# Altium project GRAVITAS_CCU_HAS.PrjPcb (part 1 of 2)
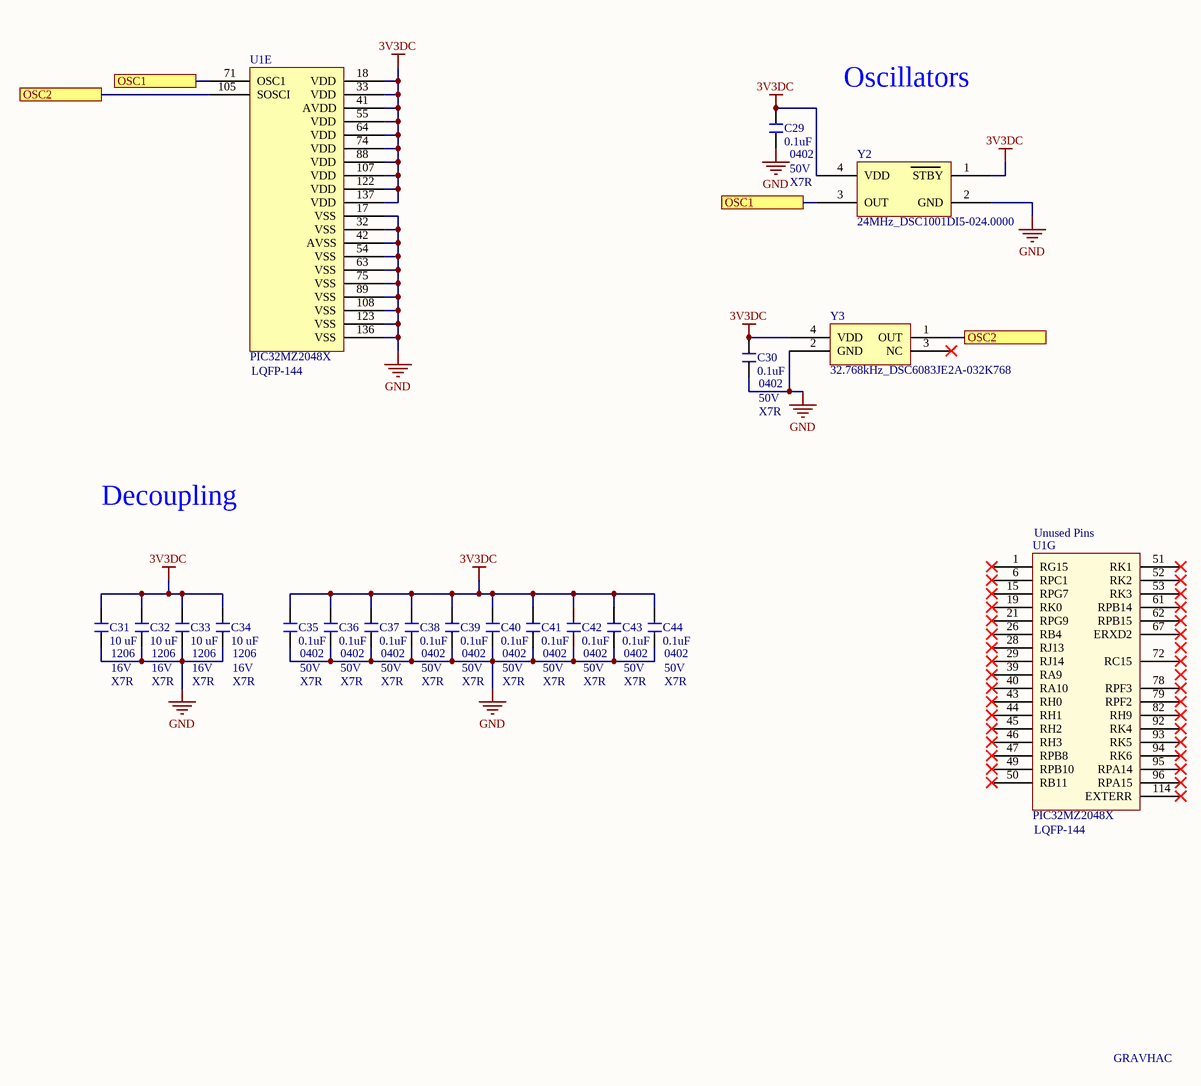
[diagram p0: MCU_SUPPORT_CCU_HAS.SchDoc]
9 sheets, 394 parts. Net scope: flat (ports and power ports of the same name join across sheets).
Board file: CCU.PcbDoc
Sheets:
  MCU_SUPPORT_CCU_HAS.SchDoc
  VREG_CCU_HAS.SchDoc
  UI_CCU_HAS.SchDoc
  USB_BREAKOUTS_CCU_HAS.SchDoc
  ETH_ICD_CCU_HAS.SchDoc
  RS485_CCU_HAS.SchDoc
  CTL_RELAY_SHEET1_CCU_HAS.SchDoc
  CTL_RELAY_SHEET2_CCU_HAS.SchDoc
  HEADERS_HAS_CCU.SchDoc

## Sheet MCU_SUPPORT_CCU_HAS.SchDoc: CCU - Microcontroller Support
size B; DrawnBy: M. Seago; Organization: Gravitas; Address1: Sponsored By:; Address2: Alan Morgan; Address3: Technical Advisor:; Address4: Dr. Joseph Morgan; Revision: 1A; SheetNumber: 1; SheetTotal: 9

### Parts
C29  0.1uF  [NonPolar-0402]
C30  0.1uF  [NonPolar-0402]
C31  10 uF  [NONPOLAR-1206]
C32  10 uF  [NONPOLAR-1206]
C33  10 uF  [NONPOLAR-1206]
C34  10 uF  [NONPOLAR-1206]
C35  0.1uF  [NonPolar-0402]
C36  0.1uF  [NonPolar-0402]
C37  0.1uF  [NonPolar-0402]
C38  0.1uF  [NonPolar-0402]
C39  0.1uF  [NonPolar-0402]
C40  0.1uF  [NonPolar-0402]
C41  0.1uF  [NonPolar-0402]
C42  0.1uF  [NonPolar-0402]
C43  0.1uF  [NonPolar-0402]
C44  0.1uF  [NonPolar-0402]
U1  PIC32MZ2048X  [BIG_PIC32MZ]  (parts E,G of 7)
Y2  24MHz_DSC1001DI5-024.0000  [12MHz_DSC1001DE2-012.0000]
Y3  32.768kHz_DSC6083JE2A-032K768  [32.768kHz_DSC6083JE2A-032K768]

### Ports
OSC1, OSC2

### Nets
3V3DC: C29.2 C30.2 C31.2 C32.2 C33.2 C34.2 C35.2 C36.2 C37.2 C38.2 C39.2 C40.2 C41.2 C42.2 C43.2 C44.2 U1.18(VDD) U1.33(VDD) U1.41(AVDD) U1.55(VDD) U1.64(VDD) U1.74(VDD) U1.88(VDD) U1.107(VDD) U1.122(VDD) U1.137(VDD) Y2.1(STBY) Y2.4(VDD) Y3.4(VDD)
GND: C29.1 C30.1 C31.1 C32.1 C33.1 C34.1 C35.1 C36.1 C37.1 C38.1 C39.1 C40.1 C41.1 C42.1 C43.1 C44.1 U1.17(VSS) U1.32(VSS) U1.42(AVSS) U1.54(VSS) U1.63(VSS) U1.75(VSS) U1.89(VSS) U1.108(VSS) U1.123(VSS) U1.136(VSS) Y2.2(GND) Y3.2(GND)
NetU1_71: U1.71(OSC1) Y2.3(OUT) ; port OSC1
NetU1_105: U1.105(SOSCI) Y3.1(OUT) ; port OSC2

Not connected (* = marked no-connect by the designer): U1 1(RG15)* 6(RPC1)* 15(RPG7)* 19(RK0)* 21(RPG9)* 26(RB4)* 28(RJ13)* 29(RJ14)* 39(RA9)* 40(RA10)* 43(RH0)* 44(RH1)* 45(RH2)* 46(RH3)* 47(RPB8)* 49(RPB10)* 50(RB11)* 51(RK1)* 52(RK2)* 53(RK3)* 61(RPB14)* 62(RPB15)* 67(ERXD2)* 72(RC15)* 78(RPF3)* 79(RPF2)* 82(RH9)* 92(RK4)* 93(RK5)* 94(RK6)* 95(RPA14)* 96(RPA15)* 114(EXTERR)*; Y3 3(NC)*

### Notes on the sheet
- Oscillators
- (near C29) 0402
- 50V
- X7R
- (near U1) LQFP-144
- (near C30) 0402
- (near C30) 50V
- (near C30) X7R
- Decoupling
- (near U1) Unused Pins
- 1206
- 16V
- (near C34) 1206
- 0402
- (near C44) 0402
- (near C44) 50V
- GRAVHAC
- Title
- Size:
- Date:
- B
- Drawn By:
- Revision:
- Sheet
- of
- File:

### Library data of the parts
C29 C30 C35-C44 = Cap - 0402
C31-C34 = Cap - 1206: CGA5L1X7R1E106K160AE

## Sheet VREG_CCU_HAS.SchDoc: CCU - Voltage Regulation
size B; DrawnBy: M. Seago; Organization: Gravitas; Address1: Sponsored By:; Address2: Alan Morgan; Address3: Technical Advisor:; Address4: Dr. Joseph Morgan; Revision: 1A; SheetNumber: 2; SheetTotal: 9
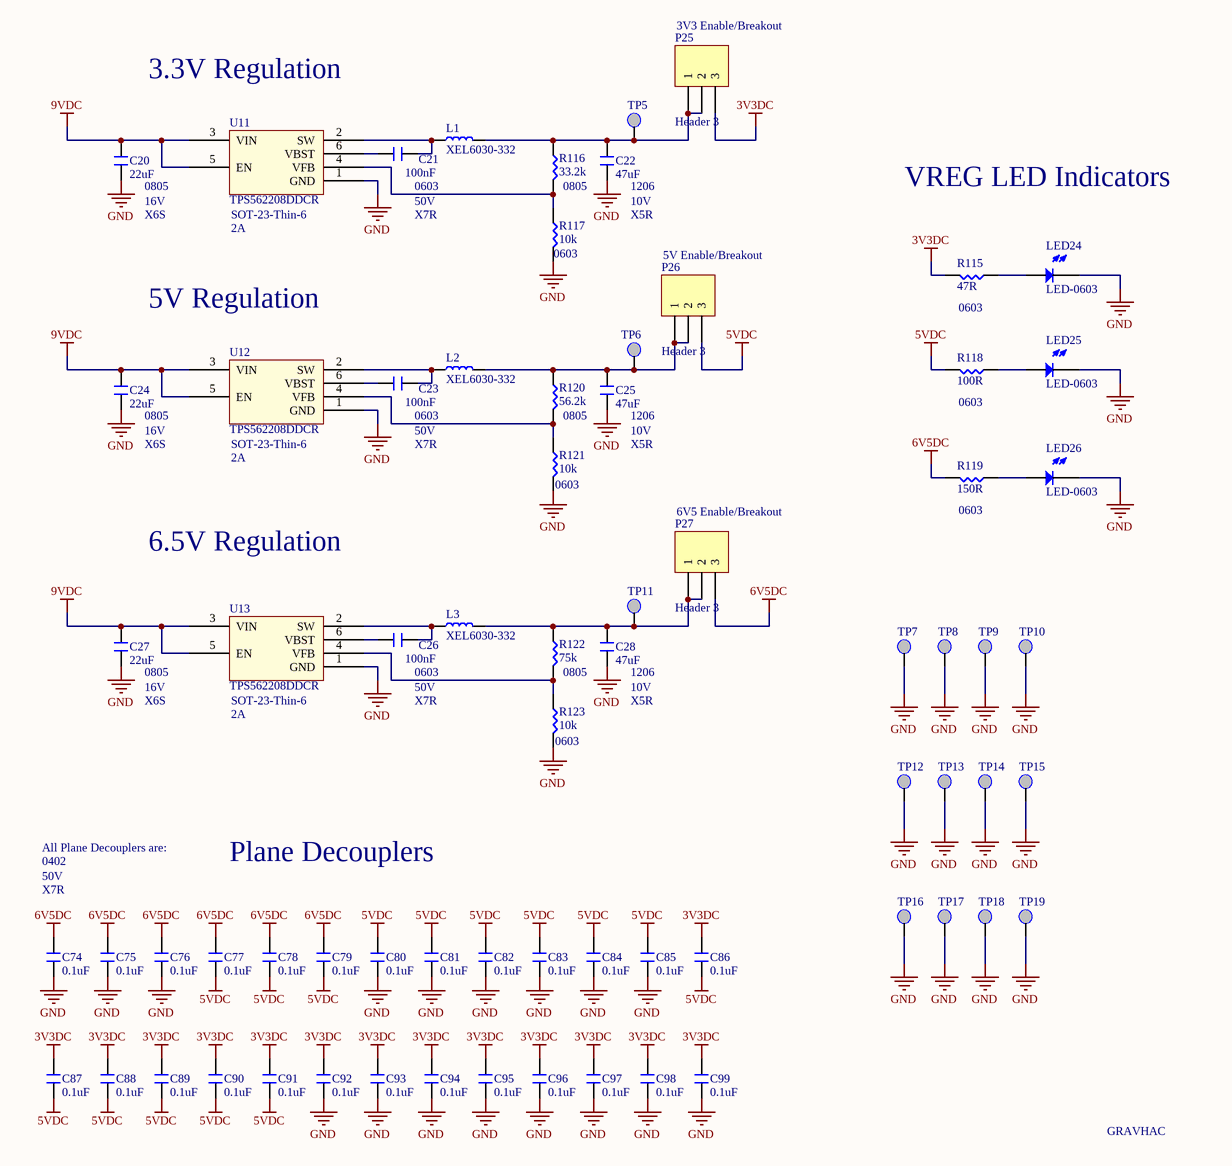
[diagram p1: VREG_CCU_HAS.SchDoc]

### Parts
C20  22uF  [NonPolar-0805]
C21  100nF  [NonPolar-0603]
C22  47uF  [NONPOLAR-1206]
C23  100nF  [NonPolar-0603]
C24  22uF  [NonPolar-0805]
C25  47uF  [NONPOLAR-1206]
C26  100nF  [NonPolar-0603]
C27  22uF  [NonPolar-0805]
C28  47uF  [NONPOLAR-1206]
C74  0.1uF  [NonPolar-0402]
C75  0.1uF  [NonPolar-0402]
C76  0.1uF  [NonPolar-0402]
C77  0.1uF  [NonPolar-0402]
C78  0.1uF  [NonPolar-0402]
C79  0.1uF  [NonPolar-0402]
C80  0.1uF  [NonPolar-0402]
C81  0.1uF  [NonPolar-0402]
C82  0.1uF  [NonPolar-0402]
C83  0.1uF  [NonPolar-0402]
C84  0.1uF  [NonPolar-0402]
C85  0.1uF  [NonPolar-0402]
C86  0.1uF  [NonPolar-0402]
C87  0.1uF  [NonPolar-0402]
C88  0.1uF  [NonPolar-0402]
C89  0.1uF  [NonPolar-0402]
C90  0.1uF  [NonPolar-0402]
C91  0.1uF  [NonPolar-0402]
C92  0.1uF  [NonPolar-0402]
C93  0.1uF  [NonPolar-0402]
C94  0.1uF  [NonPolar-0402]
C95  0.1uF  [NonPolar-0402]
C96  0.1uF  [NonPolar-0402]
C97  0.1uF  [NonPolar-0402]
C98  0.1uF  [NonPolar-0402]
C99  0.1uF  [NonPolar-0402]
L1  XEL6030-332  [XEL6030-33uH]
L2  XEL6030-332  [XEL6030-33uH]
L3  XEL6030-332  [XEL6030-33uH]
LED24  LED-0603  [LED-0603]
LED25  LED-0603  [LED-0603]
LED26  LED-0603  [LED-0603]
P25  Header 3  [HDR1X3]
P26  Header 3  [HDR1X3]
P27  Header 3  [HDR1X3]
R115  47R  [NonPolar-0603]
R116  33.2k  [NonPolar-0805]
R117  10k  [NonPolar-0603]
R118  100R  [NonPolar-0603]
R119  150R  [NonPolar-0603]
R120  56.2k  [NonPolar-0805]
R121  10k  [NonPolar-0603]
R122  75k  [NonPolar-0805]
R123  10k  [NonPolar-0603]
TP5  TestPoint  [TP - S2751-46R]  (value not drawn)
TP6  TestPoint  [TP - S2751-46R]  (value not drawn)
TP7  TestPoint  [TP - S2751-46R]  (value not drawn)
TP8  TestPoint  [TP - S2751-46R]  (value not drawn)
TP9  TestPoint  [TP - S2751-46R]  (value not drawn)
TP10  TestPoint  [TP - S2751-46R]  (value not drawn)
TP11  TestPoint  [TP - S2751-46R]  (value not drawn)
TP12  TestPoint  [TP - S2751-46R]  (value not drawn)
TP13  TestPoint  [TP - S2751-46R]  (value not drawn)
TP14  TestPoint  [TP - S2751-46R]  (value not drawn)
TP15  TestPoint  [TP - S2751-46R]  (value not drawn)
TP16  TestPoint  [TP - S2751-46R]  (value not drawn)
TP17  TestPoint  [TP - S2751-46R]  (value not drawn)
TP18  TestPoint  [TP - S2751-46R]  (value not drawn)
TP19  TestPoint  [TP - S2751-46R]  (value not drawn)
U11  TPS562208DDCR  [TPS562208DDCR]
U12  TPS562208DDCR  [TPS562208DDCR]
U13  TPS562208DDCR  [TPS562208DDCR]

### Nets
3V3DC: C86.2 C87.2 C88.2 C89.2 C90.2 C91.2 C92.2 C93.2 C94.2 C95.2 C96.2 C97.2 C98.2 C99.2 P25.3 R115.1
5VDC: C77.1 C78.1 C79.1 C80.2 C81.2 C82.2 C83.2 C84.2 C85.2 C86.1 C87.1 C88.1 C89.1 C90.1 C91.1 P26.3 R118.1
6V5DC: C74.2 C75.2 C76.2 C77.2 C78.2 C79.2 P27.3 R119.1
9VDC: C20.2 C24.2 C27.2 U11.3(VIN) U11.5(EN) U12.3(VIN) U12.5(EN) U13.3(VIN) U13.5(EN)
GND: C20.1 C22.1 C24.1 C25.1 C27.1 C28.1 C74.1 C75.1 C76.1 C80.1 C81.1 C82.1 C83.1 C84.1 C85.1 C92.1 C93.1 C94.1 C95.1 C96.1 C97.1 C98.1 C99.1 LED24.2 LED25.2 LED26.2 R117.1 R121.1 R123.1 TP7.1 TP8.1 TP9.1 TP10.1 TP12.1 TP13.1 TP14.1 TP15.1 TP16.1 TP17.1 TP18.1 TP19.1 U11.1(GND) U12.1(GND) U13.1(GND)
NetC21_1: C21.1 U11.6(VBST)
NetC21_2: C21.2 L1.1 U11.2(SW)
NetC22_2: C22.2 L1.2 P25.1 P25.2 R116.2 TP5.1
NetC23_1: C23.1 U12.6(VBST)
NetC23_2: C23.2 L2.1 U12.2(SW)
NetC25_2: C25.2 L2.2 P26.1 P26.2 R120.2 TP6.1
NetC26_1: C26.1 U13.6(VBST)
NetC26_2: C26.2 L3.1 U13.2(SW)
NetC28_2: C28.2 L3.2 P27.1 P27.2 R122.2 TP11.1
NetLED24_1: LED24.1 R115.2
NetLED25_1: LED25.1 R118.2
NetLED26_1: LED26.1 R119.2
NetR116_1: R116.1 R117.2 U11.4(VFB)
NetR120_1: R120.1 R121.2 U12.4(VFB)
NetR122_1: R122.1 R123.2 U13.4(VFB)

### Notes on the sheet
- (near P25) 3V3 Enable/Breakout
- 3.3V Regulation
- (near C20) 0805
- (near C20) 16V
- 0603
- 50V
- (near R116) 0805
- (near C22) 1206
- (near C22) 10V
- VREG LED Indicators
- X6S
- (near U11) SOT-23-Thin-6
- (near U11) 2A
- X7R
- (near R117) 0603
- X5R
- (near P26) 5V Enable/Breakout
- 5V Regulation
- (near R115) 0603
- (near R118) 0603
- (near C24) 0805
- (near C24) 16V
- (near U12) SOT-23-Thin-6
- (near U12) 2A
- (near R120) 0805
- (near C25) 1206
- (near C25) 10V
- (near R121) 0603
- (near P27) 6V5 Enable/Breakout
- (near R119) 0603
- 6.5V Regulation
- (near C27) 0805
- (near R122) 0805
- (near C28) 1206
- (near C27) 16V
- (near U13) SOT-23-Thin-6
- (near U13) 2A
- (near R123) 0603
- (near C28) 10V
- 0402
- All Plane Decouplers are:
- Plane Decouplers
- GRAVHAC
- Title
- Size:
- Date:
- B
- Drawn By:
- Revision:
- Sheet
- of
- File:

### Library data of the parts
C20 C24 C27 = Cap - 0805
C21 C23 C26 = Cap - 0603
C22 C25 C28 = Cap - 1206
C74-C99 = Cap - 0402
P25-P27 = Header 3: Header, 3-Pin; LatestRevisionDate: 17-Jul-2002; LatestRevisionNote: Re-released for DXP Platform.; Publisher: Altium Limited
R115 R117-R119 R121 R123 = Res - 0603
R116 R120 R122 = Res - 0805
TP5-TP19 = TestPoint: S2751-46R
U11-U13 = TPS562208DDCR: 4.5V to 17V Input, 2A Output, Synchronous Step-Down Converter

## Sheet UI_CCU_HAS.SchDoc: CCU - User Interface
size B; DrawnBy: M. Seago; Organization: Gravitas; Address1: Sponsored By:; Address2: Alan Morgan; Address3: Technical Advisor:; Address4: Dr. Joseph Morgan; Revision: 1A; SheetNumber: 3; SheetTotal: 9
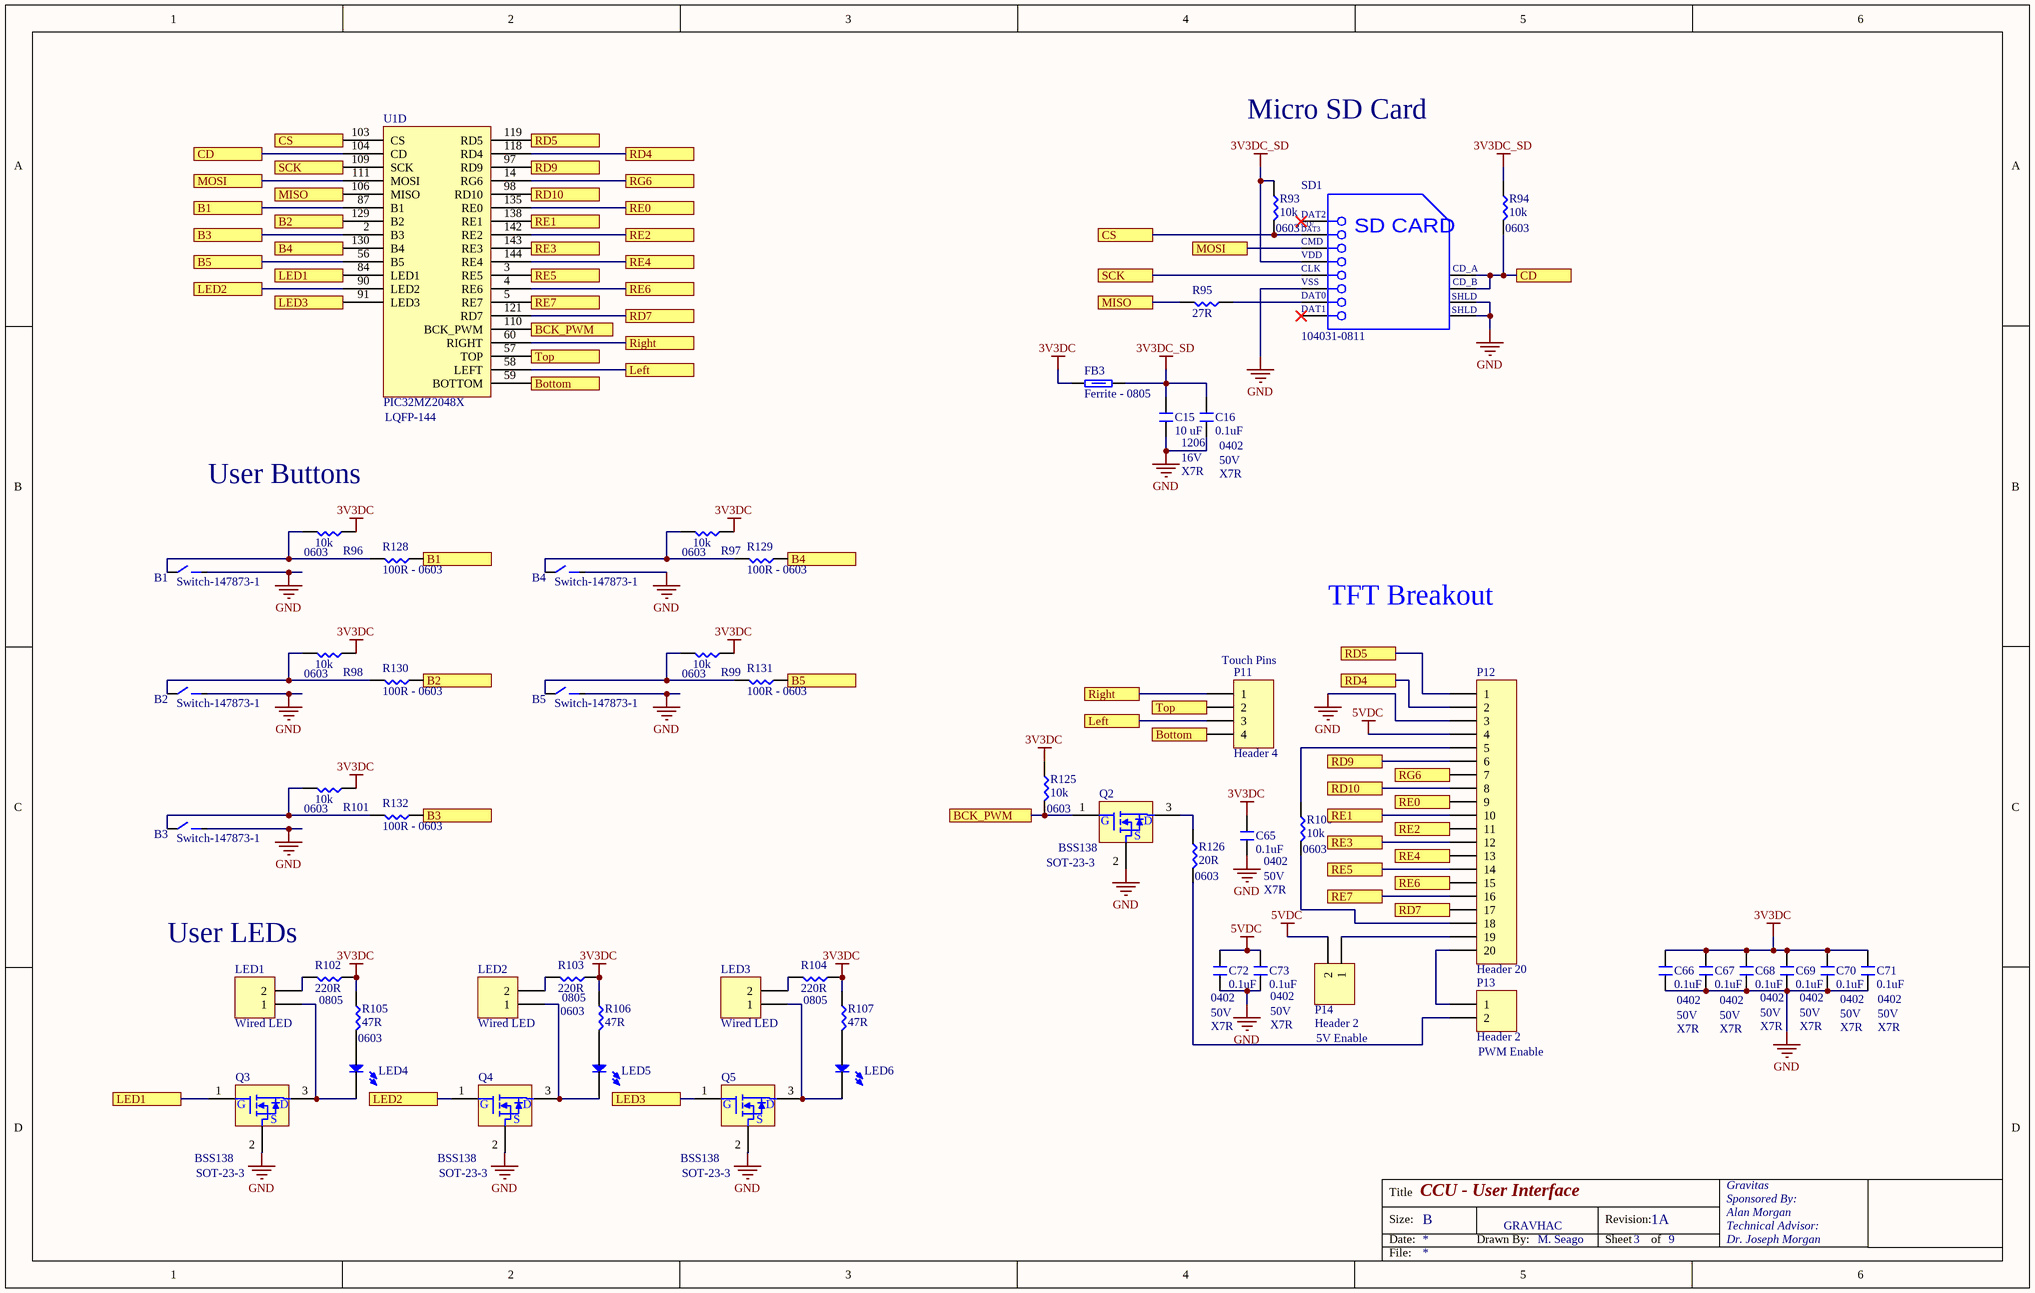
[diagram p2: UI_CCU_HAS.SchDoc]

### Parts
B1  Switch-147873-1  [Switch - 147873-1]
B2  Switch-147873-1  [Switch - 147873-1]
B3  Switch-147873-1  [Switch - 147873-1]
B4  Switch-147873-1  [Switch - 147873-1]
B5  Switch-147873-1  [Switch - 147873-1]
C15  10 uF  [NONPOLAR-1206]
C16  0.1uF  [NonPolar-0402]
C65  0.1uF  [NonPolar-0402]
C66  0.1uF  [NonPolar-0402]
C67  0.1uF  [NonPolar-0402]
C68  0.1uF  [NonPolar-0402]
C69  0.1uF  [NonPolar-0402]
C70  0.1uF  [NonPolar-0402]
C71  0.1uF  [NonPolar-0402]
C72  0.1uF  [NonPolar-0402]
C73  0.1uF  [NonPolar-0402]
FB3  Ferrite - 0805  [NonPolar-0805]
LED1  Wired LED  [HDR1X2]
LED2  Wired LED  [HDR1X2]
LED3  Wired LED  [HDR1X2]
LED4  LED-0603  [LED-0603]  (value not drawn)
LED5  LED-0603  [LED-0603]  (value not drawn)
LED6  LED-0603  [LED-0603]  (value not drawn)
P11  Header 4  [HDR1X4]
P12  Header 20  [HDR1X20]
P13  Header 2  [HDR1X2]
P14  Header 2  [HDR1X2]
Q2  BSS138  [BSS138-SOT23]
Q3  BSS138  [BSS138-SOT23]
Q4  BSS138  [BSS138-SOT23]
Q5  BSS138  [BSS138-SOT23]
R93  10k  [NonPolar-0603]
R94  10k  [NonPolar-0603]
R95  27R  [NonPolar-0603]
R96  10k  [NonPolar-0603]
R97  10k  [NonPolar-0603]
R98  10k  [NonPolar-0603]
R99  10k  [NonPolar-0603]
R100  10k  [NonPolar-0603]
R101  10k  [NonPolar-0603]
R102  220R  [NonPolar-0805]
R103  220R  [NonPolar-0805]
R104  220R  [NonPolar-0805]
R105  47R  [NonPolar-0603]
R106  47R  [NonPolar-0603]
R107  47R  [NonPolar-0603]
R125  10k  [NonPolar-0603]
R126  20R  [NonPolar-0603]
R128  100R - 0603  [NonPolar-0603]
R129  100R - 0603  [NonPolar-0603]
R130  100R - 0603  [NonPolar-0603]
R131  100R - 0603  [NonPolar-0603]
R132  100R - 0603  [NonPolar-0603]
SD1  104031-0811  [MOLX-104031-0811_V]
U1  PIC32MZ2048X  [BIG_PIC32MZ]  (part D of 7)

### Ports
B1, B2, B3, B4, B5, BCK_PWM, Bottom, CD, CS, LED1, LED2, LED3, Left, MISO, MOSI, RD4, RD5, RD7, RD9, RD10, RE0, RE1, RE2, RE3, RE4, RE5, RE6, RE7, RG6, Right, SCK, Top

### Nets
3V3DC: C65.2 C66.2 C67.2 C68.2 C69.2 C70.2 C71.2 FB3.1 R96.2 R97.2 R98.2 R99.2 R101.2 R102.2 R103.2 R104.2 R105.2 R106.2 R107.2 R125.2
3V3DC_SD: C15.2 C16.2 FB3.2 R93.2 R94.2 SD1.4(VDD)
5VDC: C72.2 C73.2 P12.4 P14.2
GND: B1.2 B2.2 B3.2 B4.2 B5.2 C15.1 C16.1 C65.1 C66.1 C67.1 C68.1 C69.1 C70.1 C71.1 C72.1 C73.1 P12.3 Q2.2(S) Q3.2(S) Q4.2(S) Q5.2(S) SD1.6(VSS2) SD1.11(SHLD1) SD1.12(SHLD2)
NetB1_1: B1.1 R96.1 R128.1
NetB2_1: B2.1 R98.1 R130.1
NetB3_1: B3.1 R101.1 R132.1
NetB4_1: B4.1 R97.1 R129.1
NetB5_1: B5.1 R99.1 R131.1
NetLED1_1: LED1.1 LED4.2 Q3.3(D)
NetLED1_2: LED1.2 R102.1
NetLED2_1: LED2.1 LED5.2 Q4.3(D)
NetLED2_2: LED2.2 R103.1
NetLED3_1: LED3.1 LED6.2 Q5.3(D)
NetLED3_2: LED3.2 R104.1
NetLED4_1: LED4.1 R105.1
NetLED5_1: LED5.1 R106.1
NetLED6_1: LED6.1 R107.1
NetP11_1: P11.1 U1.60(RIGHT) ; port Right
NetP11_2: P11.2 U1.57(TOP) ; port Top
NetP11_3: P11.3 U1.58(LEFT) ; port Left
NetP11_4: P11.4 U1.59(BOTTOM) ; port Bottom
NetP12_1: P12.1 U1.119(RD5) ; port RD5
NetP12_2: P12.2 U1.118(RD4) ; port RD4
NetP12_5: P12.5 R100.2
NetP12_6: P12.6 U1.97(RD9) ; port RD9
NetP12_7: P12.7 U1.14(RG6) ; port RG6
NetP12_8: P12.8 U1.98(RD10) ; port RD10
NetP12_9: P12.9 U1.135(RE0) ; port RE0
NetP12_10: P12.10 U1.138(RE1) ; port RE1
NetP12_11: P12.11 U1.142(RE2) ; port RE2
NetP12_12: P12.12 U1.143(RE3) ; port RE3
NetP12_13: P12.13 U1.144(RE4) ; port RE4
NetP12_14: P12.14 U1.3(RE5) ; port RE5
NetP12_15: P12.15 U1.4(RE6) ; port RE6
NetP12_16: P12.16 U1.5(RE7) ; port RE7
NetP12_17: P12.17 U1.121(RD7) ; port RD7
NetP12_18: P12.18 R100.1
NetP12_19: P12.19 P14.1
NetP12_20: P12.20 P13.1
NetP13_2: P13.2 R126.1
NetP22_1: SD1.5(CLK) U1.109(SCK) ; port SCK
NetP22_2: SD1.3(VSS1) U1.111(MOSI) ; port MOSI
NetP22_3: R95.1 U1.106(MISO) ; port MISO
NetQ2_1: Q2.1(G) R125.1 U1.110(BCK_PWM) ; port BCK_PWM
NetQ2_3: Q2.3(D) R126.2
NetQ3_1: Q3.1(G) U1.84(LED1) ; port LED1
NetQ4_1: Q4.1(G) U1.90(LED2) ; port LED2
NetQ5_1: Q5.1(G) U1.91(LED3) ; port LED3
NetR93_1: R93.1 SD1.2(CMD) U1.103(CS) ; port CS
NetR94_1: R94.1 SD1.9(CD_A) SD1.10(CD_B) U1.104(CD) ; port CD
NetR95_2: R95.2 SD1.7(DAT0)
NetR128_2: R128.2 U1.87(B1) ; port B1
NetR129_2: R129.2 U1.130(B4) ; port B4
NetR130_2: R130.2 U1.129(B2) ; port B2
NetR131_2: R131.2 U1.56(B5) ; port B5
NetR132_2: R132.2 U1.2(B3) ; port B3

Not connected (* = marked no-connect by the designer): SD1 1(CD/DAT3)* 8(DAT1)*

### Notes on the sheet
- Micro SD Card
- (near R93) 0603
- (near R94) 0603
- (near U1) LQFP-144
- (near R96) User Buttons
- 1206
- 16V
- X7R
- (near C16) 0402
- (near C16) 50V
- (near R96) 0603
- (near R97) 0603
- TFT Breakout
- (near R98) 0603
- (near R99) 0603
- (near P11) Touch Pins
- (near R101) 0603
- (near R125) 0603
- (near Q2) SOT-23-3
- (near R126) 0603
- 0402
- 50V
- (near R100) 0603
- User LEDs
- 0805
- (near R105) 0603
- (near R106) 0603
- (near C72) 0402
- (near C73) 0402
- (near C73) 50V
- 5V Enable
- (near C71) 0402
- (near C71) 50V
- (near P13) PWM Enable
- (near Q3) SOT-23-3
- (near Q4) SOT-23-3
- (near Q5) SOT-23-3
- GRAVHAC
- Title
- Size:
- Date:
- B
- Drawn By:
- Revision:
- Sheet
- of
- File:
- (in symbol CMP-2000-05825-1) DAT2; CD/; DAT3; SD CARD; VSS; SHLD

### Library data of the parts
C15 = Cap - 1206: CGA5L1X7R1E106K160AE
C16 C65-C73 = Cap - 0402
LED1-LED3 P13 P14 = Header 2: Header, 2-Pin; LatestRevisionDate: 17-Jul-2002; LatestRevisionNote: Re-released for DXP Platform.; Publisher: Altium Limited
P11 = Header 4: Header, 4-Pin; LatestRevisionDate: 17-Jul-2002; LatestRevisionNote: Re-released for DXP Platform.; Publisher: Altium Limited
P12 = Header 20: Header, 20-Pin; LatestRevisionDate: 17-Jul-2002; LatestRevisionNote: Re-released for DXP Platform.; Publisher: Altium Limited
R93-R101 R105-R107 R125 R126 R128-R132 = Res - 0603
R102-R104 = Res - 0805
SD1 = CMP-2000-05825-1: Micro SD Card, RA, -25 to 85 degC, 8-Pin SMD, RoHS, Tape and Reel; Voltage Rating: 10VAC/DC; Number of Contacts: 8; Insertion - Extraction Style: Push-Pull; Pitch: 1.1mm; Mating Cycles: 10000; Brand: Molex; Current Rating: 500mA; Manufacturer URL: http://www.molex.com/; Card Type: microSD; Mounting Type: Standard; Height: 1.42mm; Mounting Technology: SurfaceMount; Contact Plating: Gold; Product Category: MemoryCardConnectors; Package Description: 8-Pin Surface Mount Device, Body 11.95 x 11.4 mm, Pitch 1.1 mm; Datasheet URL: http://www.molex.com/pdm_docs/sd/1040310811_sd.pdf; Termination Style: SMD; Length: 11.4mm; Housing Material: LiquidCrystalPolymer(LCP); Orientation: RightAngle; RoHS: True; Contact Material: PhosphorBronze; Datasheet Version: Rev. E, 04/2006; Packaging: Reel; Manufacturer: Molex; Series: 104031; Product: CardConnectors; Number of Rows: 1Row; Package Reference: 104031-0811

## Sheet USB_BREAKOUTS_CCU_HAS.SchDoc: CCU - USB/Sensor/Breakouts
size B; DrawnBy: M. Seago; Organization: Gravitas; Address1: Sponsored By:; Address2: Alan Morgan; Address3: Technical Advisor:; Address4: Dr. Joseph Morgan; Revision: 1A; SheetNumber: 4; SheetTotal: 9
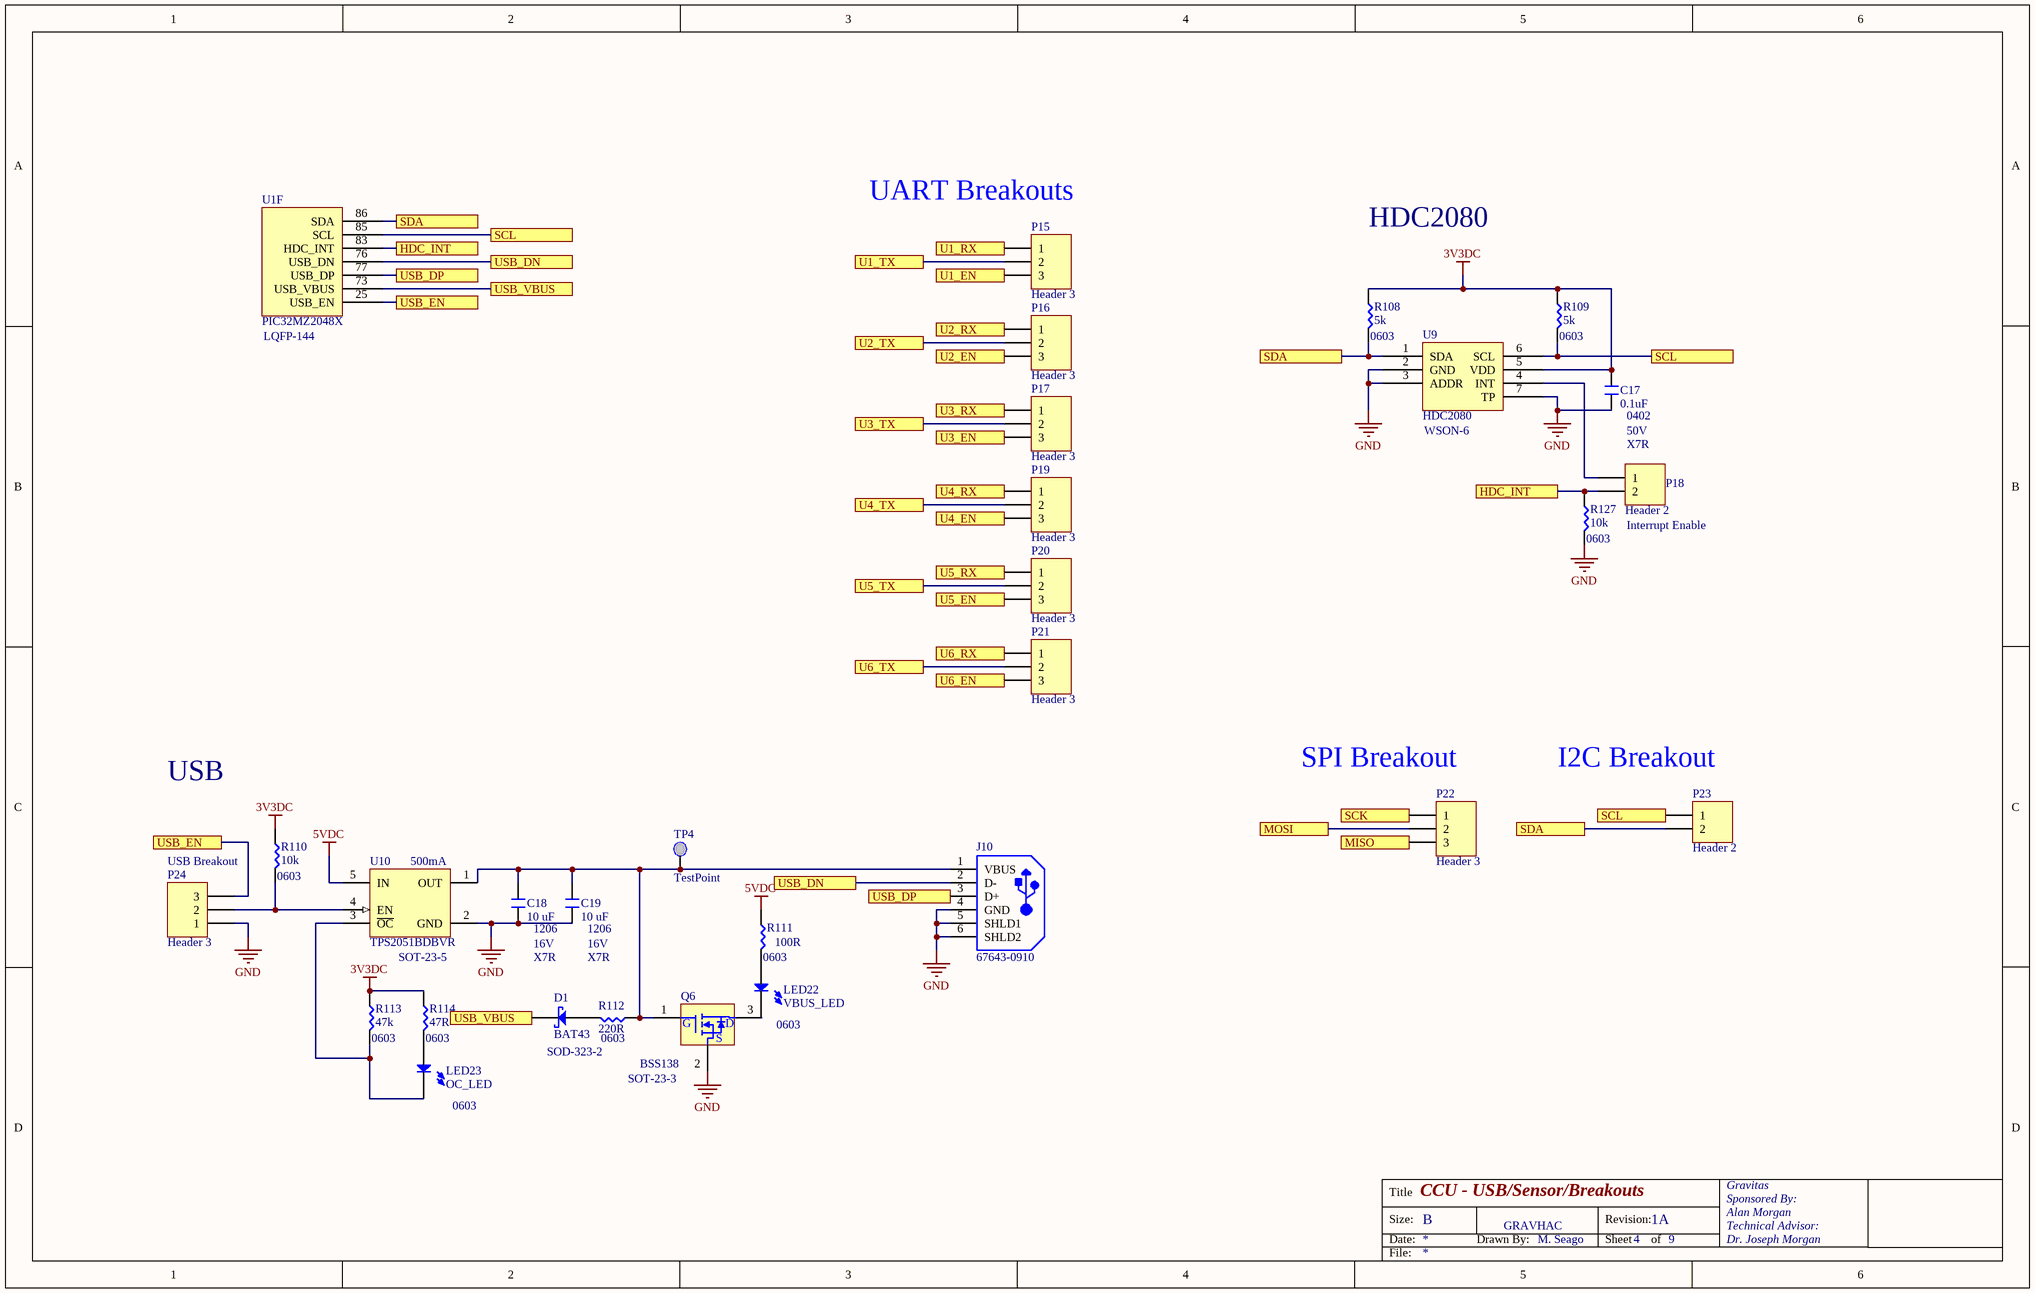
[diagram p3: USB_BREAKOUTS_CCU_HAS.SchDoc]

### Parts
C17  0.1uF  [NonPolar-0402]
C18  10 uF  [NONPOLAR-1206]
C19  10 uF  [NONPOLAR-1206]
D1  BAT43  [BAT43WS-E3-08]
J10  67643-0910  [TE-292303-1_V]
LED22  VBUS_LED  [LED-0603]
LED23  OC_LED  [LED-0603]
P15  Header 3  [HDR1X3]
P16  Header 3  [HDR1X3]
P17  Header 3  [HDR1X3]
P18  Header 2  [HDR1X2]
P19  Header 3  [HDR1X3]
P20  Header 3  [HDR1X3]
P21  Header 3  [HDR1X3]
P22  Header 3  [HDR1X3]
P23  Header 2  [HDR1X2]
P24  Header 3  [HDR1X3]
Q6  BSS138  [BSS138-SOT23]
R108  5k  [NonPolar-0603]
R109  5k  [NonPolar-0603]
R110  10k  [NonPolar-0603]
R111  100R  [NonPolar-0603]
R112  220R  [NonPolar-0603]
R113  47k  [NonPolar-0603]
R114  47R  [NonPolar-0603]
R127  10k  [NonPolar-0603]
TP4  TestPoint  [TP - S2751-46R]
U1  PIC32MZ2048X  [BIG_PIC32MZ]  (part F of 7)
U9  HDC2080  [HDC2080]
U10  TPS2051BDBVR  [DBV0005A_L]

### Ports
HDC_INT, MISO, MOSI, SCK, SCL, SDA, U1_EN, U1_RX, U1_TX, U2_EN, U2_RX, U2_TX, U3_EN, U3_RX, U3_TX, U4_EN, U4_RX, U4_TX, U5_EN, U5_RX, U5_TX, U6_EN, U6_RX, U6_TX, USB_DN, USB_DP, USB_EN, USB_VBUS

### Nets
3V3DC: C17.2 R108.2 R109.2 R110.2 R113.2 R114.2 U9.5(VDD)
5VDC: R111.2 U10.5(IN)
GND: C17.1 C18.1 C19.1 J10.4(GND) J10.5(SHLD1) J10.6(SHLD2) P24.1 Q6.2(S) R127.1 U9.2(GND) U9.3(ADDR) U9.7(TP) U10.2(GND)
NetC18_2: C18.2 C19.2 J10.1(VBUS) Q6.1(G) R112.2 TP4.1 U10.1(OUT)
NetD1_1: D1.1 U1.73(USB_VBUS) ; port USB_VBUS
NetD1_2: D1.2 R112.1
NetJ10_2: J10.2(D-) U1.76(USB_DN) ; port USB_DN
NetJ10_3: J10.3(D+) U1.77(USB_DP) ; port USB_DP
NetLED22_1: LED22.1 R111.1
NetLED22_2: LED22.2 Q6.3(D)
NetLED23_1: LED23.1 R114.1
NetLED23_2: LED23.2 R113.1 U10.3(~{OC})
NetP15_1: P15.1 ; port U1_RX
NetP15_2: P15.2 ; port U1_TX
NetP15_3: P15.3 ; port U1_EN
NetP16_1: P16.1 ; port U2_RX
NetP16_2: P16.2 ; port U2_TX
NetP16_3: P16.3 ; port U2_EN
NetP17_1: P17.1 ; port U3_RX
NetP17_2: P17.2 ; port U3_TX
NetP17_3: P17.3 ; port U3_EN
NetP18_1: P18.1 U9.4(INT)
NetP18_2: P18.2 R127.2 U1.83(HDC_INT) ; port HDC_INT
NetP19_1: P19.1 ; port U4_RX
NetP19_2: P19.2 ; port U4_TX
NetP19_3: P19.3 ; port U4_EN
NetP20_1: P20.1 ; port U5_RX
NetP20_2: P20.2 ; port U5_TX
NetP20_3: P20.3 ; port U5_EN
NetP21_1: P21.1 ; port U6_RX
NetP21_2: P21.2 ; port U6_TX
NetP21_3: P21.3 ; port U6_EN
NetP22_1: P22.1 ; port SCK
NetP22_2: P22.2 ; port MOSI
NetP22_3: P22.3 ; port MISO
NetP23_1: P23.1 R109.1 U1.85(SCL) U9.6(SCL) ; port SCL
NetP23_2: P23.2 R108.1 U1.86(SDA) U9.1(SDA) ; port SDA
NetP24_2: P24.2 R110.1 U10.4(EN)
NetP24_3: P24.3 U1.25(USB_EN) ; port USB_EN

### Notes on the sheet
- (near P15) UART Breakouts
- HDC2080
- (near U1) LQFP-144
- (near R108) 0603
- (near R109) 0603
- (near U9) WSON-6
- (near C17) 0402
- 50V
- (near P18) X7R
- (near R127) 0603
- Interrupt Enable
- (near P22) SPI Breakout
- (near P23) I2C Breakout
- USB
- USB Breakout
- (near R110) 0603
- (near U10) 500mA
- SOT-23-5
- 1206
- 16V
- X7R
- (near C19) 1206
- (near C19) 16V
- (near R111) 0603
- (near R113) 0603
- (near R114) 0603
- (near R112) 0603
- 0603
- (near LED23) 0603
- SOD-323-2
- (near Q6) SOT-23-3
- GRAVHAC
- Title
- Size:
- Date:
- B
- Drawn By:
- Revision:
- Sheet
- of
- File:

### Library data of the parts
C17 = Cap - 0402
C18 C19 = Cap - 1206: CGA5L1X7R1E106K160AE
D1 = BAT43: BAT43WS-E3-08
J10 = CMP-2000-05404-1: 1 Port Right Angle Through Hole Mount Female Type A USB Connector, 4 Position, -55 to 85 degC, RoHS, Tube; Manufacturer: TE Connectivity; Contact Termination Type: Solder; No. of Contacts: 4; Connector Mounting: PCB; SVHC: NoSVHC(16-Jun-2014); Gender: Receptacle; Connector Type: USBA; Package Description: 4-Pin Through Hole Device, Body 14 x 13.13 mm, Pitch 2.5 mm; Contact Plating: Gold; Package Reference: 292303-1; Contact Material: Copper; Datasheet URL: http://www.farnell.com/cad/1653030.pdf; Datasheet Version: Feb-12; Manufacturer URL: http://www.te.com/
LED22 LED23 = LED-0603
P15-P17 P19-P22 P24 = Header 3: Header, 3-Pin; LatestRevisionDate: 17-Jul-2002; LatestRevisionNote: Re-released for DXP Platform.; Publisher: Altium Limited
P18 P23 = Header 2: Header, 2-Pin; LatestRevisionDate: 17-Jul-2002; LatestRevisionNote: Re-released for DXP Platform.; Publisher: Altium Limited
R108-R114 R127 = Res - 0603
TP4 = TestPoint: S2751-46R
U10 = CMP-2000-07277-1: Current-Limited, Power-Distribution Switch, 2.7 to 5.5 V, -40 to 85 degC, 5-Pin SOT-23 (DBV), Green (RoHS & no Sb/Br), Tape and Reel; Manufacturer: TexasInstruments; Number of Outputs: 1Output; Operating Supply Voltage: 2.7Vto5.5V; Supply Voltage - Min: 2.7V; Supply Voltage - Max: 5.5V; Current Limit: 1A; Development Kit: TPS2051BEVM; Output Current: 500mA; On Resistance - Max: 70mOhms; Package Version: 4073253-4/N, 12/2014; Mounting Technology: SurfaceMount; Packaging: Reel; Package / Case: SOT-23-5; Maximum Operating Temperature: +85C; Package Description: 5-Pin Small Outline Transistor, Body 2.9 x 1.6 mm, Pitch 0.95 mm; Type: HighSide; Product: USBCurrentLimitedPowerSwitches; Minimum Operating Temperature: -40C; Manufacturer URL: http://www.ti.com/; Factory Pack Quantity: 3000; Mounting Style: SMD/SMT; Brand: TexasInstruments; Package Reference: DBV5; Package URL: http://www.ti.com/lit/ml/mpds018l/mpds018l.pdf; Datasheet URL: http://www.ti.com/general/docs/lit/getliterature.tsp?genericPartNumber=TPS2051B&fileType=pdf; Product Category: PowerSwitchICs-PowerDistribution; Series: TPS2051B; Datasheet Version: Rev. L, 06/2011; RoHS: Details

## Sheet ETH_ICD_CCU_HAS.SchDoc: CCU - Ethernet/USB/Reset
size B; DrawnBy: M. Seago; Organization: Gravitas; Address1: Sponsored By:; Address2: Alan Morgan; Address3: Technical Advisor:; Address4: Dr. Joseph Morgan; Revision: 1A; SheetNumber: 5; SheetTotal: 9
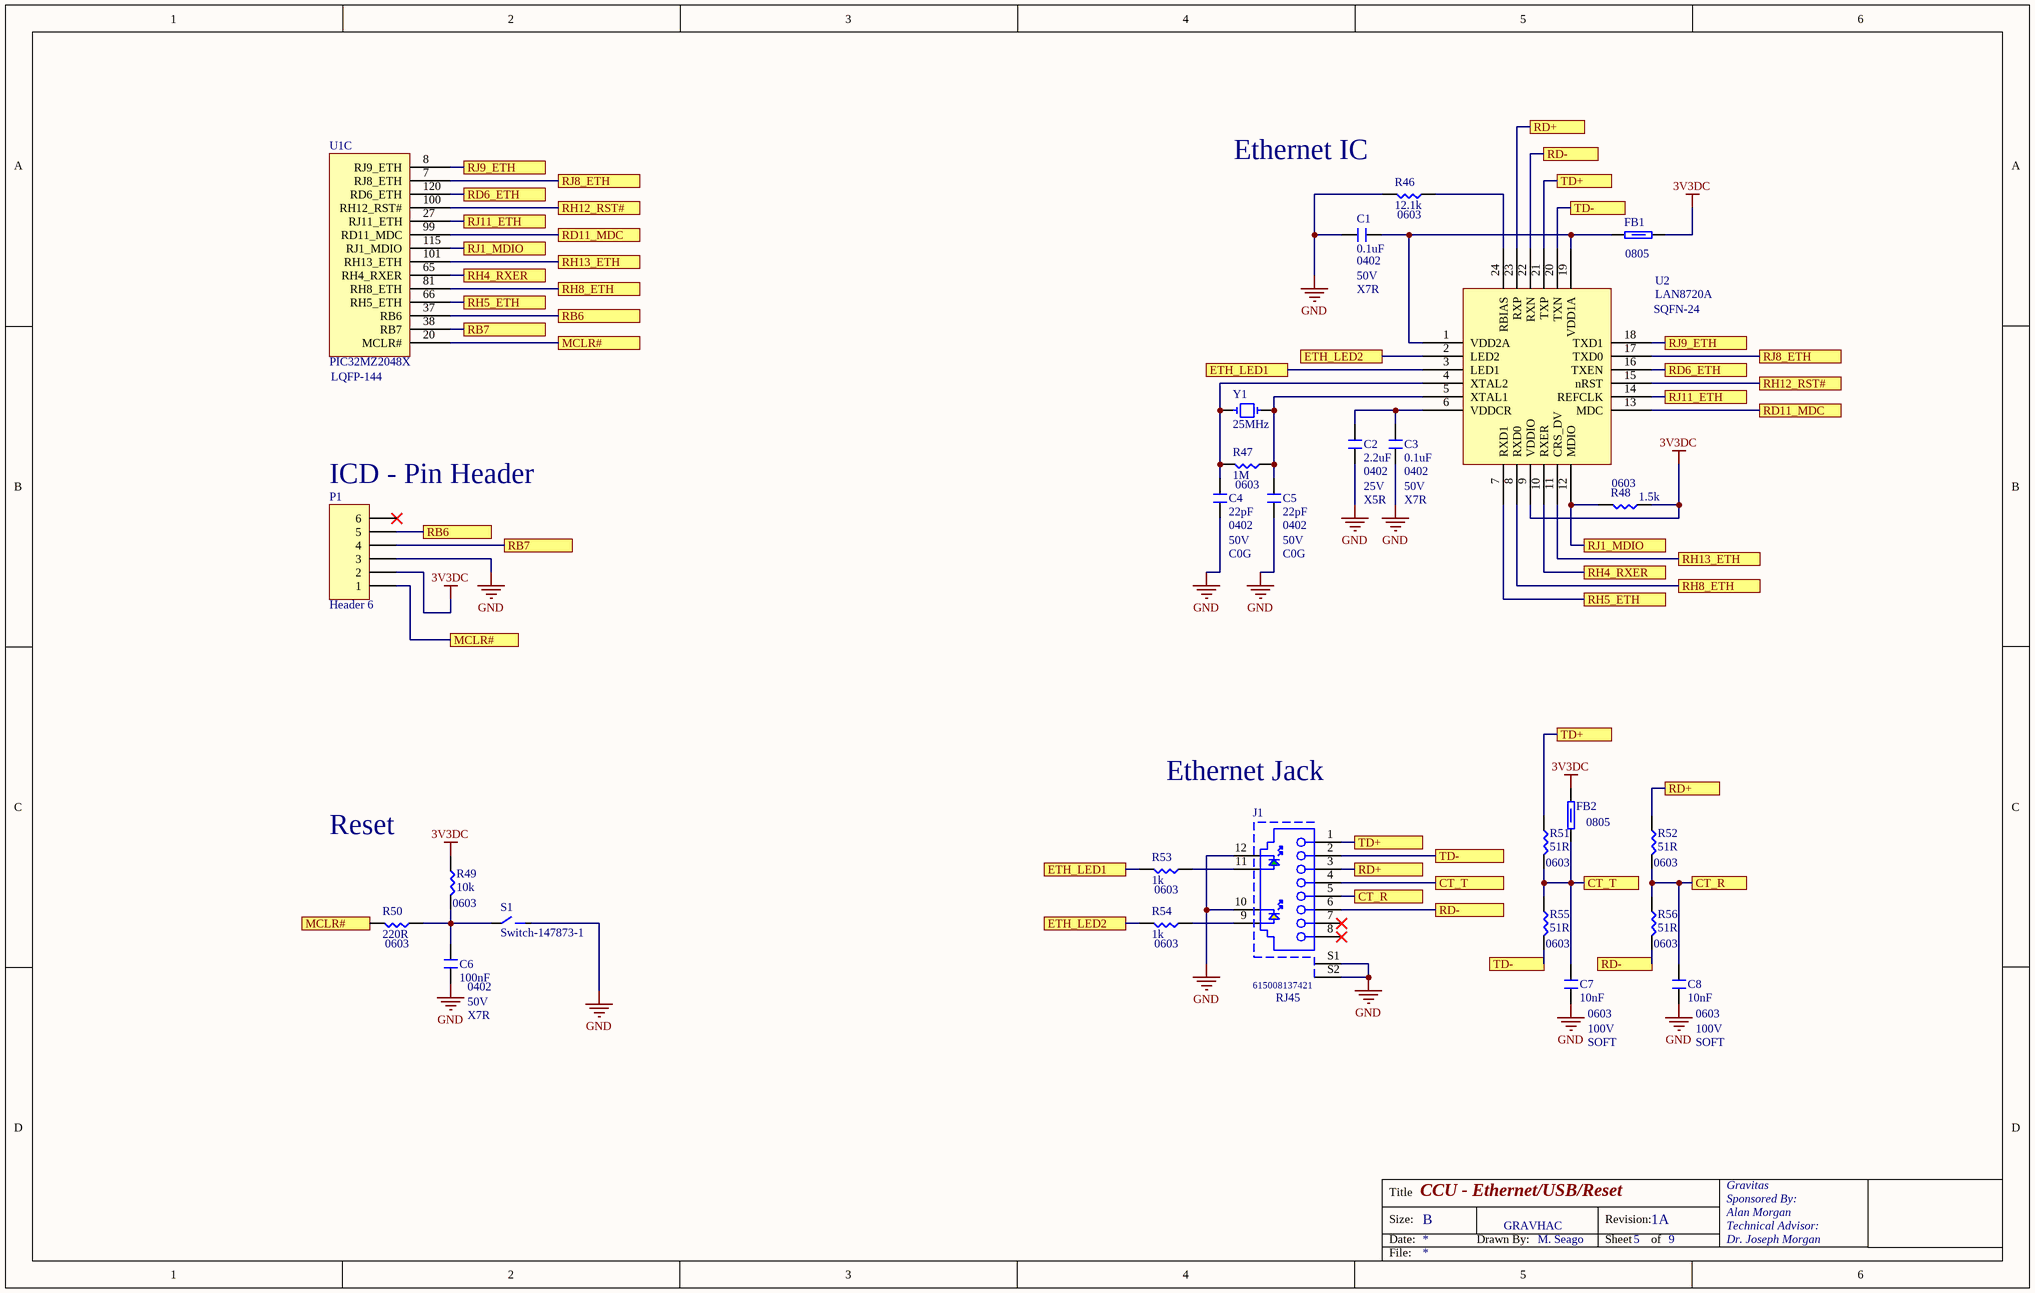
[diagram p4: ETH_ICD_CCU_HAS.SchDoc]

### Parts
C1  0.1uF  [NonPolar-0402]
C2  2.2uF  [NonPolar-0402]
C3  0.1uF  [NonPolar-0402]
C4  22pF  [NonPolar-0402]
C5  22pF  [NonPolar-0402]
C6  100nF  [NonPolar-0402]
C7  10nF  [NonPolar-0603]
C8  10nF  [NonPolar-0603]
FB1  Ferrite - 0805  [NonPolar-0805]  (value not drawn)
FB2  Ferrite - 0805  [NonPolar-0805]  (value not drawn)
J1  615008137421  [615008137421]
P1  Header 6  [HDR1X6]
R46  12.1k  [NonPolar-0603]
R47  1M  [NonPolar-0603]
R48  1.5k  [NonPolar-0603]
R49  10k  [NonPolar-0603]
R50  220R  [NonPolar-0603]
R51  51R  [NonPolar-0603]
R52  51R  [NonPolar-0603]
R53  1k  [NonPolar-0603]
R54  1k  [NonPolar-0603]
R55  51R  [NonPolar-0603]
R56  51R  [NonPolar-0603]
S1  Switch-147873-1  [Switch - 147873-1]
U1  PIC32MZ2048X  [BIG_PIC32MZ]  (part C of 7)
U2  LAN8720A  [LAN8720A]
Y1  25MHz  [7A-25.000MAAJ-T]

### Ports
CT_R, CT_T, ETH_LED1, ETH_LED2, MCLR#, RB6, RB7, RD6_ETH, RD11_MDC, RD+, RD-, RH4_RXER, RH5_ETH, RH8_ETH, RH12_RST#, RH13_ETH, RJ1_MDIO, RJ8_ETH, RJ9_ETH, RJ11_ETH, TD+, TD-

### Nets
3V3DC: FB1.2 FB2.2 P1.2 R48.2 R49.2 U2.9(VDDIO)
GND: C1.1 C2.1 C3.1 C4.1 C5.1 C6.1 C7.1 C8.1 J1.10 J1.12 J1.S1 J1.S2 P1.3 R46.1 S1.2
NetC1_2: C1.2 FB1.1 U2.1(VDD2A) U2.19(VDD1A)
NetC2_2: C2.2 C3.2 U2.6(VDDCR)
NetC4_2: C4.2 R47.1 U2.4(XTAL2) Y1.1
NetC5_2: C5.2 R47.2 U2.5(XTAL1) Y1.2
NetC6_2: C6.2 R49.1 R50.2 S1.1
NetC7_2: C7.2 FB2.1 J1.4 R51.1 R55.2 ; port CT_T
NetC8_2: C8.2 J1.5 R52.1 R56.2 ; port CT_R
NetJ1_1: J1.1 R51.2 U2.21(TXP) ; port TD+
NetJ1_2: J1.2 R55.1 U2.20(TXN) ; port TD-
NetJ1_3: J1.3 R52.2 U2.23(RXP) ; port RD+
NetJ1_6: J1.6 R56.1 U2.22(RXN) ; port RD-
NetJ1_9: J1.9 R54.2
NetJ1_11: J1.11 R53.2
NetP1_1: P1.1 R50.1 U1.20(MCLR#) ; port MCLR#
NetP1_4: P1.4 U1.38(RB7) ; port RB7
NetP1_5: P1.5 U1.37(RB6) ; port RB6
NetR46_2: R46.2 U2.24(RBIAS)
NetR48_1: R48.1 U1.115(RJ1_MDIO) U2.12(MDIO) ; port RJ1_MDIO
NetR53_1: R53.1 U2.3(LED1) ; port ETH_LED1
NetR54_1: R54.1 U2.2(LED2) ; port ETH_LED2
NetU1_7: U1.7(RJ8_ETH) U2.17(TXD0) ; port RJ8_ETH
NetU1_8: U1.8(RJ9_ETH) U2.18(TXD1) ; port RJ9_ETH
NetU1_27: U1.27(RJ11_ETH) U2.14(REFCLK) ; port RJ11_ETH
NetU1_65: U1.65(RH4_RXER) U2.10(RXER) ; port RH4_RXER
NetU1_66: U1.66(RH5_ETH) U2.7(RXD1) ; port RH5_ETH
NetU1_81: U1.81(RH8_ETH) U2.8(RXD0) ; port RH8_ETH
NetU1_99: U1.99(RD11_MDC) U2.13(MDC) ; port RD11_MDC
NetU1_100: U1.100(RH12_RST#) U2.15(nRST) ; port RH12_RST#
NetU1_101: U1.101(RH13_ETH) U2.11(CRS_DV) ; port RH13_ETH
NetU1_120: U1.120(RD6_ETH) U2.16(TXEN) ; port RD6_ETH

Not connected (* = marked no-connect by the designer): J1 7* 8*; P1 6*

### Notes on the sheet
- (near R46) Ethernet IC
- (near R46) 0603
- (near C1) 0402
- (near C1) 50V
- (near C1) X7R
- (near FB1) 0805
- (near U2) SQFN-24
- (near U1) LQFP-144
- (near P1) ICD - Pin Header
- 0603
- 0402
- 25V
- X5R
- (near C3) 0402
- 50V
- X7R
- C0G
- (near C5) 0402
- (near C5) 50V
- (near C5) C0G
- Reset
- Ethernet Jack
- (near FB2) 0805
- (near R49) 0603
- (near R51) 0603
- (near R52) 0603
- (near R50) 0603
- (near R54) 0603
- (near R55) 0603
- (near R56) 0603
- (near C6) 0402
- (near C6) 50V
- (near C6) X7R
- (near J1) RJ45
- (near C7) 0603
- (near C7) 100V
- (near C7) SOFT
- (near C8) 0603
- (near C8) 100V
- (near C8) SOFT
- GRAVHAC
- Title
- Size:
- Date:
- B
- Drawn By:
- Revision:
- Sheet
- of
- File:

### Library data of the parts
C1-C6 = Cap - 0402
C7 C8 = Cap - 0603
J1 = CMP-1502-01697-1: Modular Jack WR-MJ, Tab Up, Shielded, with LED and EMI Panel Finger, Horizontal Entry, THT, 8P8C; Manufacturer: Wurth Elektronik; Compliance: Leadfree/RoHS; Withstanding Voltage: 1000VAC; Port: 1x1; Contact Resistance: 20mOhm; Rated Current: 1.5A; Working Voltage: 120VAC; Manufacturer URL: http://www.we-online.de; Mounting Technology: THT; Entrance: Horizontal; Datasheet URL: https://katalog.we-online.de/em/datasheet/615008137421.pdf; Packaging: Tray; Package Reference: 615008137421; Publisher: WurthElektronik; Operating Temperature: -40to85degC; Part Number: 615008137421; Pin Number: 8P8C
P1 = Header 6: Header, 6-Pin; LatestRevisionDate: 17-Jul-2002; LatestRevisionNote: Re-released for DXP Platform.; Publisher: Altium Limited
R46-R56 = Res - 0603
Y1 = 25MHz -7A-25.000MAAJ-T

## Sheet RS485_CCU_HAS.SchDoc: CCU- RS485
size B; DrawnBy: M. Seago; Organization: Gravitas; Address1: Sponsored By:; Address2: Alan Morgan; Address3: Technical Advisor:; Address4: Dr. Joseph Morgan; Revision: 1A; SheetNumber: 6; SheetTotal: 9
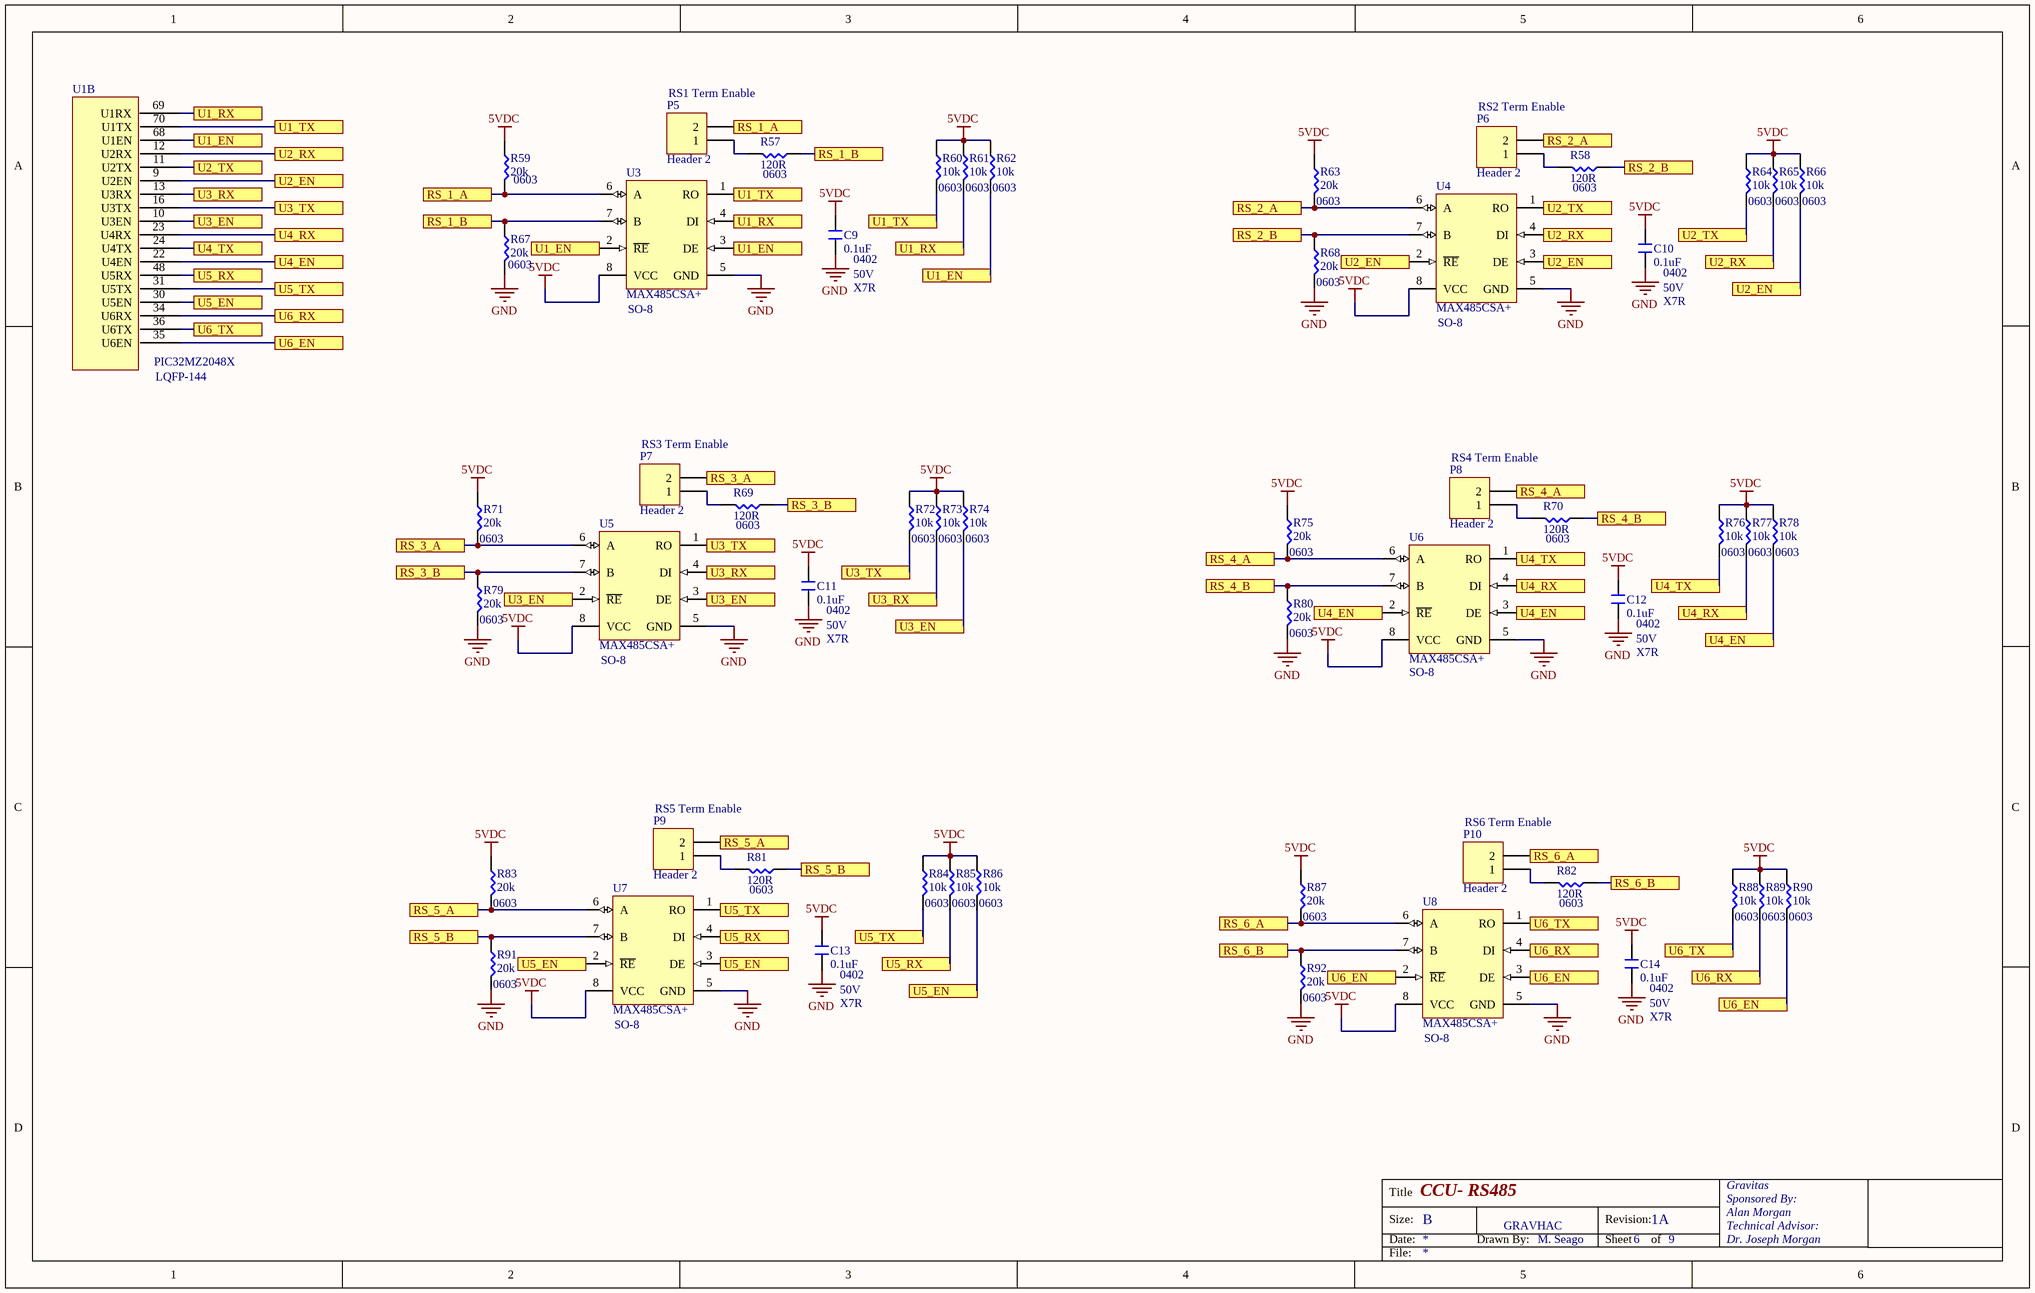
[diagram p5: RS485_CCU_HAS.SchDoc]

### Parts
C9  0.1uF  [NonPolar-0402]
C10  0.1uF  [NonPolar-0402]
C11  0.1uF  [NonPolar-0402]
C12  0.1uF  [NonPolar-0402]
C13  0.1uF  [NonPolar-0402]
C14  0.1uF  [NonPolar-0402]
P5  Header 2  [HDR1X2]
P6  Header 2  [HDR1X2]
P7  Header 2  [HDR1X2]
P8  Header 2  [HDR1X2]
P9  Header 2  [HDR1X2]
P10  Header 2  [HDR1X2]
R57  120R  [NonPolar-0603]
R58  120R  [NonPolar-0603]
R59  20k  [NonPolar-0603]
R60  10k  [NonPolar-0603]
R61  10k  [NonPolar-0603]
R62  10k  [NonPolar-0603]
R63  20k  [NonPolar-0603]
R64  10k  [NonPolar-0603]
R65  10k  [NonPolar-0603]
R66  10k  [NonPolar-0603]
R67  20k  [NonPolar-0603]
R68  20k  [NonPolar-0603]
R69  120R  [NonPolar-0603]
R70  120R  [NonPolar-0603]
R71  20k  [NonPolar-0603]
R72  10k  [NonPolar-0603]
R73  10k  [NonPolar-0603]
R74  10k  [NonPolar-0603]
R75  20k  [NonPolar-0603]
R76  10k  [NonPolar-0603]
R77  10k  [NonPolar-0603]
R78  10k  [NonPolar-0603]
R79  20k  [NonPolar-0603]
R80  20k  [NonPolar-0603]
R81  120R  [NonPolar-0603]
R82  120R  [NonPolar-0603]
R83  20k  [NonPolar-0603]
R84  10k  [NonPolar-0603]
R85  10k  [NonPolar-0603]
R86  10k  [NonPolar-0603]
R87  20k  [NonPolar-0603]
R88  10k  [NonPolar-0603]
R89  10k  [NonPolar-0603]
R90  10k  [NonPolar-0603]
R91  20k  [NonPolar-0603]
R92  20k  [NonPolar-0603]
U1  PIC32MZ2048X  [BIG_PIC32MZ]  (part B of 7)
U3  MAX485CSA+  [MAXM-MAX485CSA+-8_M]
U4  MAX485CSA+  [MAXM-MAX485CSA+-8_M]
U5  MAX485CSA+  [MAXM-MAX485CSA+-8_M]
U6  MAX485CSA+  [MAXM-MAX485CSA+-8_M]
U7  MAX485CSA+  [MAXM-MAX485CSA+-8_M]
U8  MAX485CSA+  [MAXM-MAX485CSA+-8_M]

### Ports
RS_1_A, RS_1_B, RS_2_A, RS_2_B, RS_3_A, RS_3_B, RS_4_A, RS_4_B, RS_5_A, RS_5_B, RS_6_A, RS_6_B, U1_EN, U1_RX, U1_TX, U2_EN, U2_RX, U2_TX, U3_EN, U3_RX, U3_TX, U4_EN, U4_RX, U4_TX, U5_EN, U5_RX, U5_TX, U6_EN, U6_RX, U6_TX

### Nets
5VDC: C9.2 C10.2 C11.2 C12.2 C13.2 C14.2 R59.2 R60.2 R61.2 R62.2 R63.2 R64.2 R65.2 R66.2 R71.2 R72.2 R73.2 R74.2 R75.2 R76.2 R77.2 R78.2 R83.2 R84.2 R85.2 R86.2 R87.2 R88.2 R89.2 R90.2 U3.8(VCC) U4.8(VCC) U5.8(VCC) U6.8(VCC) U7.8(VCC) U8.8(VCC)
GND: C9.1 C10.1 C11.1 C12.1 C13.1 C14.1 R67.1 R68.1 R79.1 R80.1 R91.1 R92.1 U3.5(GND) U4.5(GND) U5.5(GND) U6.5(GND) U7.5(GND) U8.5(GND)
NetJ6_2: R69.2 R79.2 U5.7(B) ; port RS_3_B
NetJ6_3: P7.2 R71.1 U5.6(A) ; port RS_3_A
NetJ6_6: R58.2 R68.2 U4.7(B) ; port RS_2_B
NetJ6_7: P6.2 R63.1 U4.6(A) ; port RS_2_A
NetJ6_10: R57.2 R67.2 U3.7(B) ; port RS_1_B
NetJ6_11: P5.2 R59.1 U3.6(A) ; port RS_1_A
NetJ9_2: R82.2 R92.2 U8.7(B) ; port RS_6_B
NetJ9_3: P10.2 R87.1 U8.6(A) ; port RS_6_A
NetJ9_6: R81.2 R91.2 U7.7(B) ; port RS_5_B
NetJ9_7: P9.2 R83.1 U7.6(A) ; port RS_5_A
NetJ9_10: R70.2 R80.2 U6.7(B) ; port RS_4_B
NetJ9_11: P8.2 R75.1 U6.6(A) ; port RS_4_A
NetP5_1: P5.1 R57.1
NetP6_1: P6.1 R58.1
NetP7_1: P7.1 R69.1
NetP8_1: P8.1 R70.1
NetP9_1: P9.1 R81.1
NetP10_1: P10.1 R82.1
NetP15_1: R61.1 U1.69(U1RX) U3.4(DI) ; port U1_RX
NetP15_2: R60.1 U1.70(U1TX) U3.1(RO) ; port U1_TX
NetP15_3: R62.1 U1.68(U1EN) U3.2(~{RE}) U3.3(DE) ; port U1_EN
NetP16_1: R65.1 U1.12(U2RX) U4.4(DI) ; port U2_RX
NetP16_2: R64.1 U1.11(U2TX) U4.1(RO) ; port U2_TX
NetP16_3: R66.1 U1.9(U2EN) U4.2(~{RE}) U4.3(DE) ; port U2_EN
NetP17_1: R73.1 U1.13(U3RX) U5.4(DI) ; port U3_RX
NetP17_2: R72.1 U1.16(U3TX) U5.1(RO) ; port U3_TX
NetP17_3: R74.1 U1.10(U3EN) U5.2(~{RE}) U5.3(DE) ; port U3_EN
NetP19_1: R77.1 U1.23(U4RX) U6.4(DI) ; port U4_RX
NetP19_2: R76.1 U1.24(U4TX) U6.1(RO) ; port U4_TX
NetP19_3: R78.1 U1.22(U4EN) U6.2(~{RE}) U6.3(DE) ; port U4_EN
NetP20_1: R85.1 U1.48(U5RX) U7.4(DI) ; port U5_RX
NetP20_2: R84.1 U1.31(U5TX) U7.1(RO) ; port U5_TX
NetP20_3: R86.1 U1.30(U5EN) U7.2(~{RE}) U7.3(DE) ; port U5_EN
NetP21_1: R89.1 U1.34(U6RX) U8.4(DI) ; port U6_RX
NetP21_2: R88.1 U1.36(U6TX) U8.1(RO) ; port U6_TX
NetP21_3: R90.1 U1.35(U6EN) U8.2(~{RE}) U8.3(DE) ; port U6_EN

### Notes on the sheet
- (near P5) RS1 Term Enable
- (near P6) RS2 Term Enable
- (near R59) 0603
- (near R57) 0603
- 0603
- (near R62) 0603
- (near R63) 0603
- (near R58) 0603
- (near R66) 0603
- (near R67) 0603
- (near C9) 0402
- (near C9) 50V
- (near C9) X7R
- (near R68) 0603
- (near C10) 0402
- (near C10) 50V
- (near U3) SO-8
- (near U4) SO-8
- (near C10) X7R
- (near U1) LQFP-144
- (near P7) RS3 Term Enable
- (near P8) RS4 Term Enable
- (near R71) 0603
- (near R69) 0603
- (near R74) 0603
- (near R75) 0603
- (near R70) 0603
- (near R78) 0603
- (near R79) 0603
- (near C11) 0402
- (near C11) 50V
- (near C11) X7R
- (near R80) 0603
- (near C12) 0402
- (near C12) 50V
- (near U5) SO-8
- (near U6) SO-8
- (near C12) X7R
- (near P9) RS5 Term Enable
- (near P10) RS6 Term Enable
- (near R83) 0603
- (near R81) 0603
- (near R86) 0603
- (near R82) 0603
- (near C13) 0402
- (near R87) 0603
- (near R90) 0603
- (near R91) 0603
- (near U7) SO-8
- (near C13) 50V
- (near C13) X7R
- (near R92) 0603
- (near U8) SO-8
- (near C14) 0402
- (near C14) 50V
- (near C14) X7R
- GRAVHAC
- Title
- Size:
- Date:
- B
- Drawn By:
- Revision:
- Sheet
- of
- File:

### Library data of the parts
C9-C14 = Cap - 0402
P5-P10 = Header 2: Header, 2-Pin; LatestRevisionDate: 17-Jul-2002; LatestRevisionNote: Re-released for DXP Platform.; Publisher: Altium Limited
R57-R92 = Res - 0603
U3-U8 = CMP-2000-05211-1: Low-Power, Slew-Rate-Limited RS-485/RS-422 Transceiver, 4.75 to 5.25 V, 0 to 70 degC, 8-Pin SOIC, RoHS, Tape and Reel; Manufacturer: Maxim; No. of Receivers: 1; Transceiver Type: Differential; Supply Voltage Min: 4.75V; IC Generic Number: 485; IC Temperature Range: Commercial; No. of Pins: 8; Supply Voltage Range: 4.75Vto5.25V; Interface: RS-422/RS-485; Supply Voltage Max: 5.25V; Data Rate: 2.5Mbps; Line / Bus Driver / Receiver / Transceiver Type: CMOSDifferential; Supply Current: 500µA; Interface Type: RS422,RS485; Device Type: Transceiver; Manufacturer URL: http://www.maximintegrated.com/; Operating Temperature Range: 0degCto+70degC; Package / Case: SOIC; Digital IC Case Style: SOIC; Operating Temperature Max: 70degC; Device Marking: MAX485CSA+; Driver Case Style: SOIC; Datasheet Version: Rev. 8, 10/2003; Operating Temperature Min: 0degC; Datasheet URL: https://datasheet.ciiva.com/29306/170071-da-01-en-ic-max485csa-so8-29306144.pdf; Base Number: 485; No. of Drivers: 1; Logic Function Number: 485

## Sheet CTL_RELAY_SHEET1_CCU_HAS.SchDoc: CCU - HVAC Relays
size B; DrawnBy: M. Seago; Organization: Gravitas; Address1: Sponsored By:; Address2: Alan Morgan; Address3: Technical Advisor:; Address4: Dr. Joseph Morgan; Revision: 1A; SheetNumber: 7; SheetTotal: 9
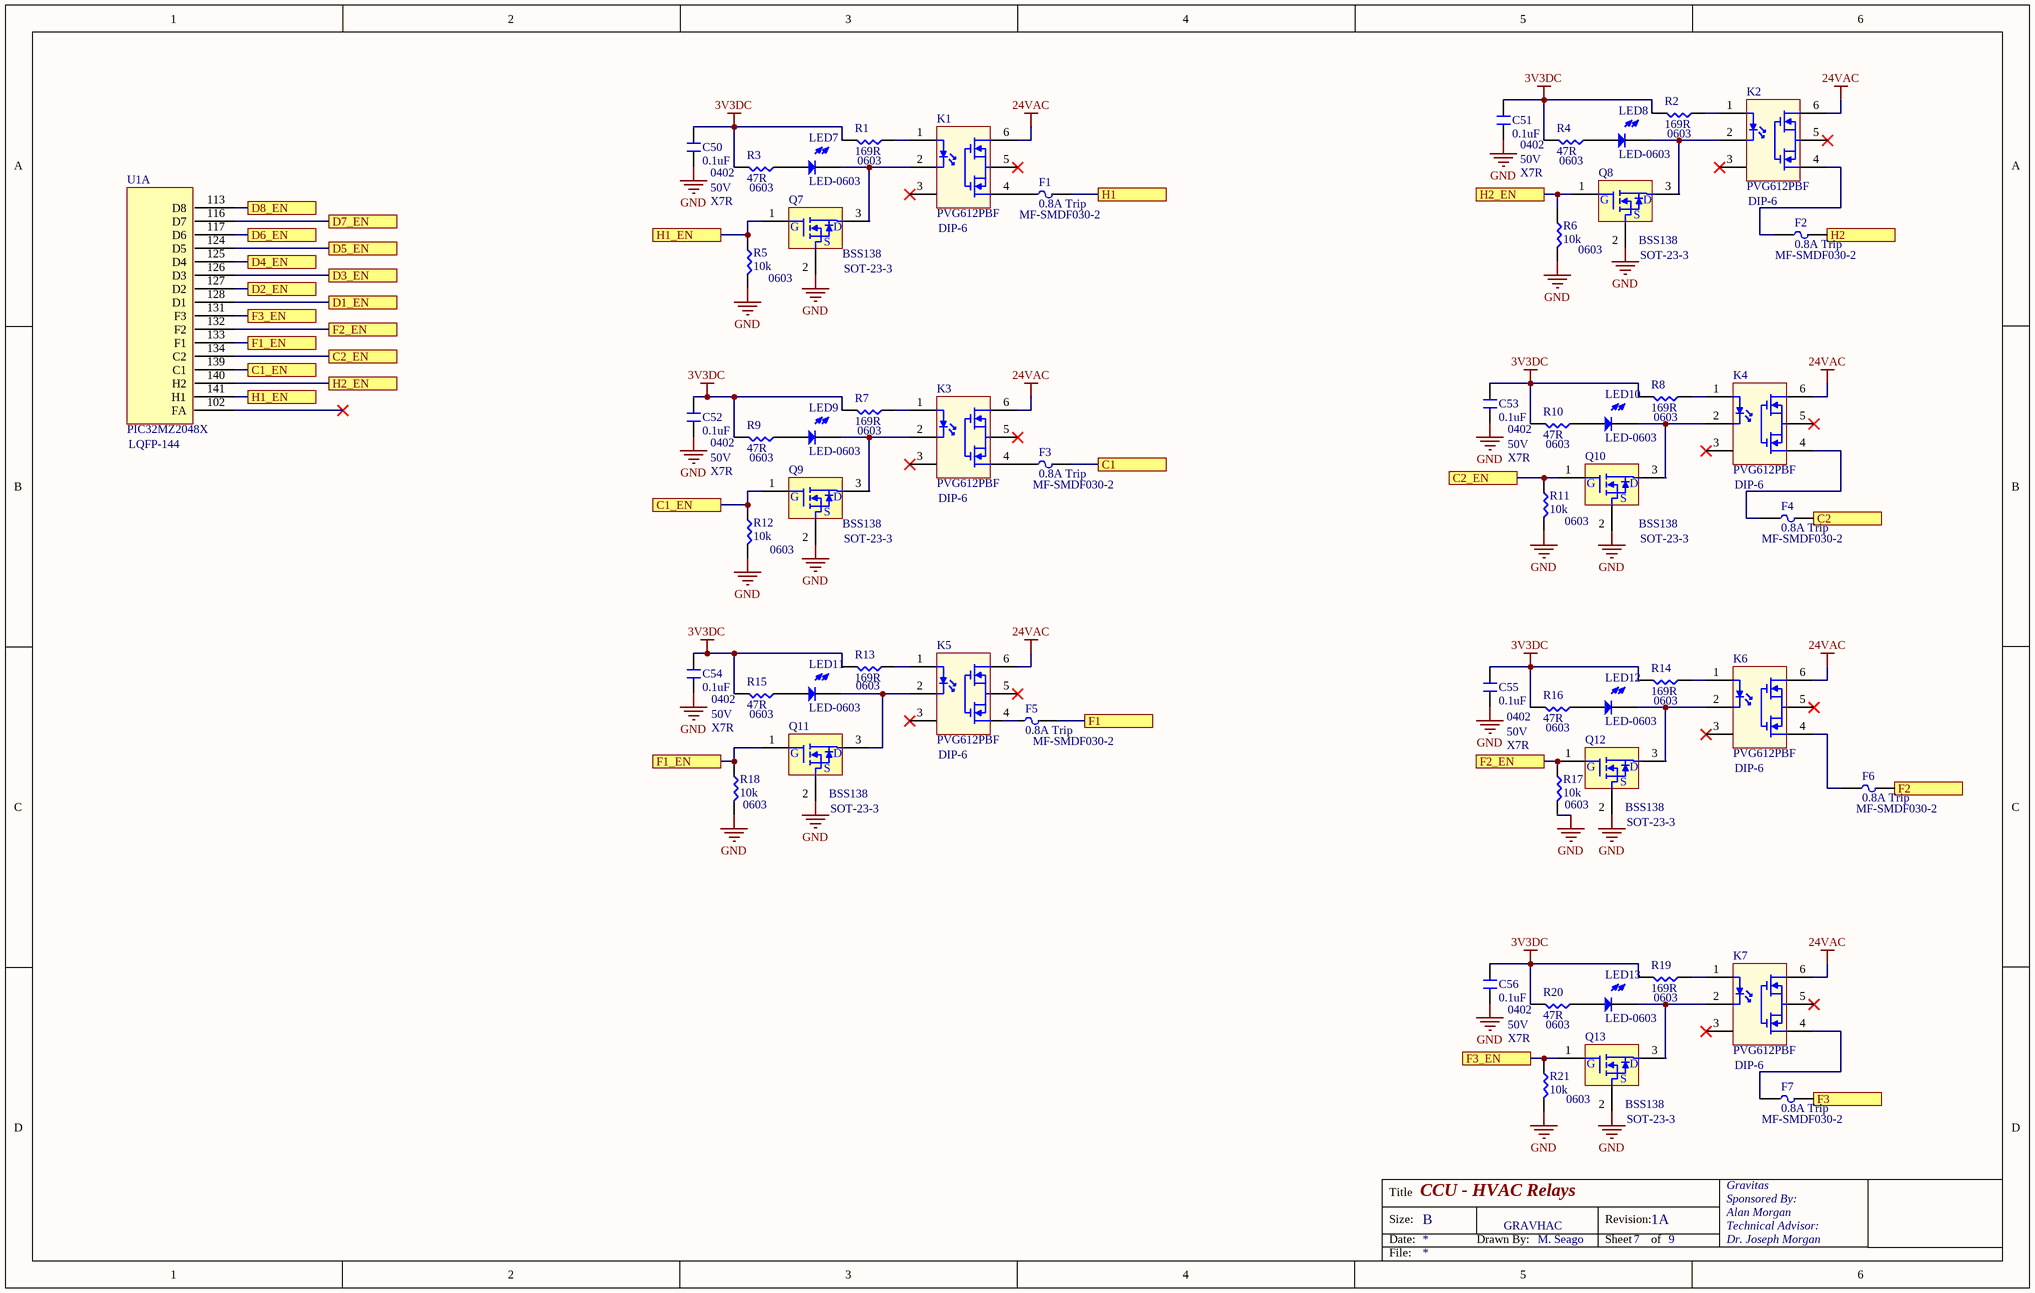
[diagram p6: CTL_RELAY_SHEET1_CCU_HAS.SchDoc]

### Parts
C50  0.1uF  [NonPolar-0402]
C51  0.1uF  [NonPolar-0402]
C52  0.1uF  [NonPolar-0402]
C53  0.1uF  [NonPolar-0402]
C54  0.1uF  [NonPolar-0402]
C55  0.1uF  [NonPolar-0402]
C56  0.1uF  [NonPolar-0402]
F1  0.8A Trip  [Fuse-MF-SMDF030-2]
F2  0.8A Trip  [Fuse-MF-SMDF030-2]
F3  0.8A Trip  [Fuse-MF-SMDF030-2]
F4  0.8A Trip  [Fuse-MF-SMDF030-2]
F5  0.8A Trip  [Fuse-MF-SMDF030-2]
F6  0.8A Trip  [Fuse-MF-SMDF030-2]
F7  0.8A Trip  [Fuse-MF-SMDF030-2]
K1  PVG612PBF  [PVG612PBF]
K2  PVG612PBF  [PVG612PBF]
K3  PVG612PBF  [PVG612PBF]
K4  PVG612PBF  [PVG612PBF]
K5  PVG612PBF  [PVG612PBF]
K6  PVG612PBF  [PVG612PBF]
K7  PVG612PBF  [PVG612PBF]
LED7  LED-0603  [LED-0603]
LED8  LED-0603  [LED-0603]
LED9  LED-0603  [LED-0603]
LED10  LED-0603  [LED-0603]
LED11  LED-0603  [LED-0603]
LED12  LED-0603  [LED-0603]
LED13  LED-0603  [LED-0603]
Q7  BSS138  [BSS138-SOT23]
Q8  BSS138  [BSS138-SOT23]
Q9  BSS138  [BSS138-SOT23]
Q10  BSS138  [BSS138-SOT23]
Q11  BSS138  [BSS138-SOT23]
Q12  BSS138  [BSS138-SOT23]
Q13  BSS138  [BSS138-SOT23]
R1  169R  [NonPolar-0603]
R2  169R  [NonPolar-0603]
R3  47R  [NonPolar-0603]
R4  47R  [NonPolar-0603]
R5  10k  [NonPolar-0603]
R6  10k  [NonPolar-0603]
R7  169R  [NonPolar-0603]
R8  169R  [NonPolar-0603]
R9  47R  [NonPolar-0603]
R10  47R  [NonPolar-0603]
R11  10k  [NonPolar-0603]
R12  10k  [NonPolar-0603]
R13  169R  [NonPolar-0603]
R14  169R  [NonPolar-0603]
R15  47R  [NonPolar-0603]
R16  47R  [NonPolar-0603]
R17  10k  [NonPolar-0603]
R18  10k  [NonPolar-0603]
R19  169R  [NonPolar-0603]
R20  47R  [NonPolar-0603]
R21  10k  [NonPolar-0603]
U1  PIC32MZ2048X  [BIG_PIC32MZ]  (part A of 7)

### Ports
C1, C1_EN, C2, C2_EN, D1_EN, D2_EN, D3_EN, D4_EN, D5_EN, D6_EN, D7_EN, D8_EN, F1, F1_EN, F2, F2_EN, F3, F3_EN, H1, H1_EN, H2, H2_EN

### Nets
3V3DC: C50.2 C51.2 C52.2 C53.2 C54.2 C55.2 C56.2 R1.1 R2.1 R3.1 R4.1 R7.1 R8.1 R9.1 R10.1 R13.1 R14.1 R15.1 R16.1 R19.1 R20.1
24VAC: K1.6 K2.6 K3.6 K4.6 K5.6 K6.6 K7.6
GND: C50.1 C51.1 C52.1 C53.1 C54.1 C55.1 C56.1 Q7.2(S) Q8.2(S) Q9.2(S) Q10.2(S) Q11.2(S) Q12.2(S) Q13.2(S) R5.1 R6.1 R11.1 R12.1 R17.1 R18.1 R21.1
NetF1_1: F1.1 K1.4
NetF1_2: F1.2 ; port H1
NetF2_1: F2.1 K2.4
NetF2_2: F2.2 ; port H2
NetF3_1: F3.1 K3.4
NetF3_2: F3.2 ; port C1
NetF4_1: F4.1 K4.4
NetF4_2: F4.2 ; port C2
NetF5_1: F5.1 K5.4
NetF5_2: F5.2 ; port F1
NetF6_1: F6.1 K6.4
NetF6_2: F6.2 ; port F2
NetF7_1: F7.1 K7.4
NetF7_2: F7.2 ; port F3
NetK1_1: K1.1 R1.2
NetK1_2: K1.2 LED7.2 Q7.3(D)
NetK2_1: K2.1 R2.2
NetK2_2: K2.2 LED8.2 Q8.3(D)
NetK3_1: K3.1 R7.2
NetK3_2: K3.2 LED9.2 Q9.3(D)
NetK4_1: K4.1 R8.2
NetK4_2: K4.2 LED10.2 Q10.3(D)
NetK5_1: K5.1 R13.2
NetK5_2: K5.2 LED11.2 Q11.3(D)
NetK6_1: K6.1 R14.2
NetK6_2: K6.2 LED12.2 Q12.3(D)
NetK7_1: K7.1 R19.2
NetK7_2: K7.2 LED13.2 Q13.3(D)
NetLED7_1: LED7.1 R3.2
NetLED8_1: LED8.1 R4.2
NetLED9_1: LED9.1 R9.2
NetLED10_1: LED10.1 R10.2
NetLED11_1: LED11.1 R15.2
NetLED12_1: LED12.1 R16.2
NetLED13_1: LED13.1 R20.2
NetQ7_1: Q7.1(G) R5.2 U1.141(H1) ; port H1_EN
NetQ8_1: Q8.1(G) R6.2 U1.140(H2) ; port H2_EN
NetQ9_1: Q9.1(G) R12.2 U1.139(C1) ; port C1_EN
NetQ10_1: Q10.1(G) R11.2 U1.134(C2) ; port C2_EN
NetQ11_1: Q11.1(G) R18.2 U1.133(F1) ; port F1_EN
NetQ12_1: Q12.1(G) R17.2 U1.132(F2) ; port F2_EN
NetQ13_1: Q13.1(G) R21.2 U1.131(F3) ; port F3_EN
NetQ14_1: U1.128(D1) ; port D1_EN
NetQ15_1: U1.127(D2) ; port D2_EN
NetQ16_1: U1.126(D3) ; port D3_EN
NetQ17_1: U1.125(D4) ; port D4_EN
NetQ18_1: U1.124(D5) ; port D5_EN
NetQ19_1: U1.117(D6) ; port D6_EN
NetQ20_1: U1.116(D7) ; port D7_EN
NetQ21_1: U1.113(D8) ; port D8_EN

Not connected (* = marked no-connect by the designer): K1 3(18)* 5(14)*; K2 3(18)* 5(14)*; K3 3(18)* 5(14)*; K4 3(18)* 5(14)*; K5 3(18)* 5(14)*; K6 3(18)* 5(14)*; K7 3(18)* 5(14)*; U1 102(FA)*

### Notes on the sheet
- (near R1) 0603
- 0402
- 50V
- (near R4) 0603
- (near R2) 0603
- X7R
- (near R3) 0603
- (near K1) DIP-6
- (near F1) MF-SMDF030-2
- DIP-6
- 0603
- (near Q7) SOT-23-3
- (near Q8) SOT-23-3
- (near F2) MF-SMDF030-2
- (near R7) 0603
- (near R10) 0402
- (near R8) 0603
- (near U1) LQFP-144
- (near R9) 0603
- (near K3) DIP-6
- (near F3) MF-SMDF030-2
- (near R10) 0603
- (near Q9) SOT-23-3
- (near Q10) SOT-23-3
- (near F4) MF-SMDF030-2
- (near R15) 0402
- (near R13) 0603
- (near R14) 0603
- (near R15) 0603
- (near K5) DIP-6
- (near F5) MF-SMDF030-2
- (near R16) 0402
- (near R16) 0603
- (near K6) DIP-6
- (near R18) 0603
- (near Q11) SOT-23-3
- (near Q12) SOT-23-3
- (near F6) MF-SMDF030-2
- (near R20) 0402
- (near R20) 0603
- (near R19) 0603
- (near Q13) 0603
- (near Q13) SOT-23-3
- (near F7) MF-SMDF030-2
- GRAVHAC
- Title
- Size:
- Date:
- B
- Drawn By:
- Revision:
- Sheet
- of
- File:

### Library data of the parts
C50-C56 = Cap - 0402
F1-F7 = Fuse-MF-SMDF030-2
K1-K7 = PVG612PBF: PhotoVoltaic Relay
R1-R21 = Res - 0603

## Sheet CTL_RELAY_SHEET2_CCU_HAS.SchDoc: CCU - Damper Relays
size B; DrawnBy: M. Seago; Organization: Gravitas; Address1: Sponsored By:; Address2: Alan Morgan; Address3: Technical Advisor:; Address4: Dr. Joseph Morgan; Revision: 1A; SheetNumber: 8; SheetTotal: 9
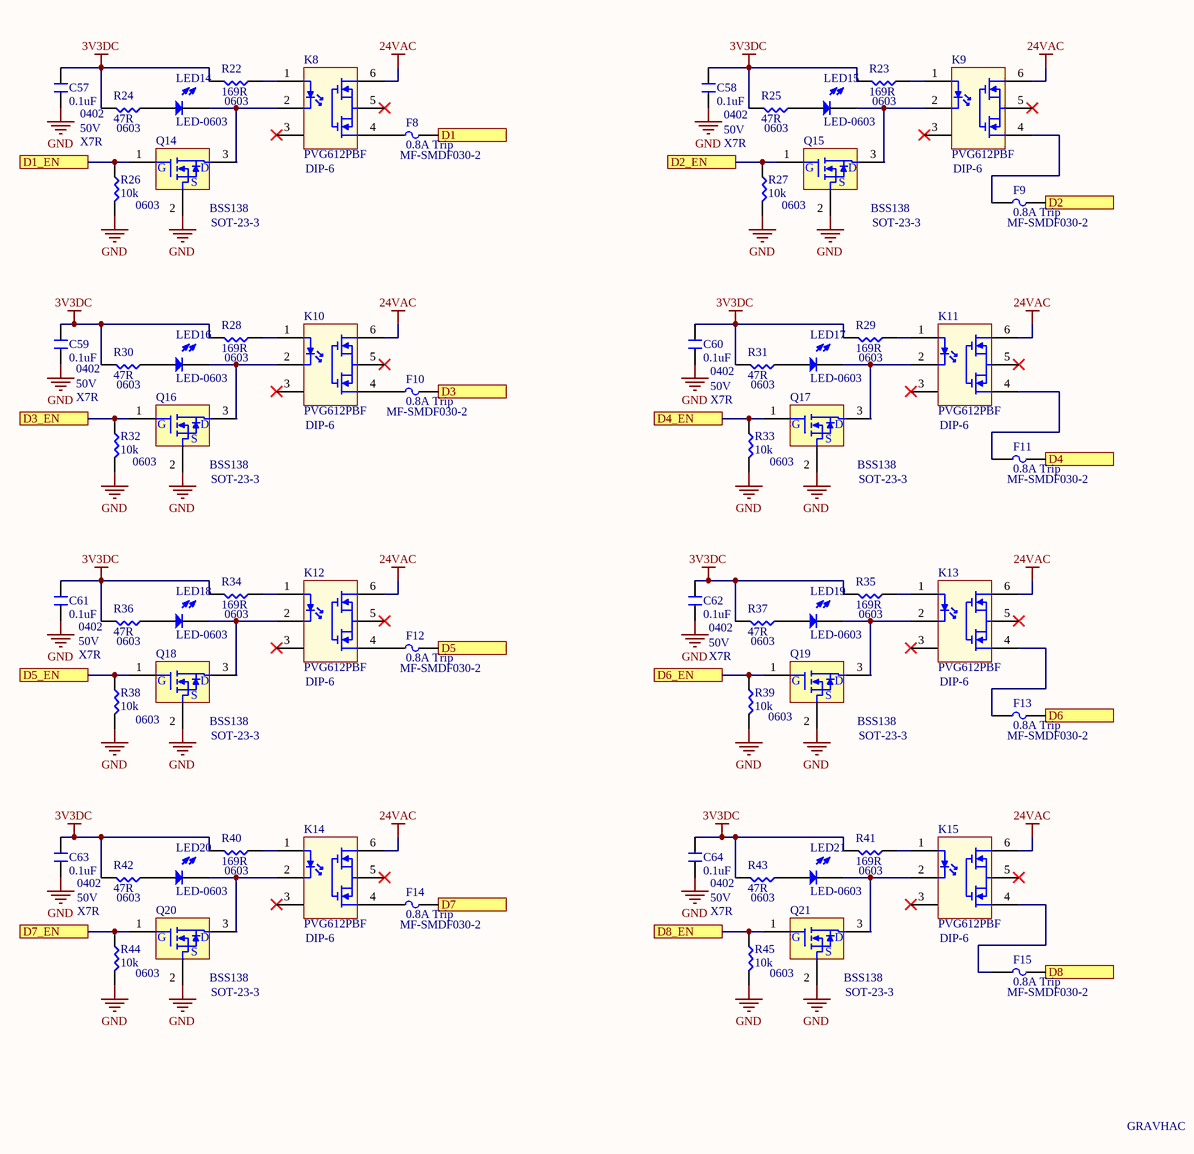
[diagram p7: CTL_RELAY_SHEET2_CCU_HAS.SchDoc]

### Parts
C57  0.1uF  [NonPolar-0402]
C58  0.1uF  [NonPolar-0402]
C59  0.1uF  [NonPolar-0402]
C60  0.1uF  [NonPolar-0402]
C61  0.1uF  [NonPolar-0402]
C62  0.1uF  [NonPolar-0402]
C63  0.1uF  [NonPolar-0402]
C64  0.1uF  [NonPolar-0402]
F8  0.8A Trip  [Fuse-MF-SMDF030-2]
F9  0.8A Trip  [Fuse-MF-SMDF030-2]
F10  0.8A Trip  [Fuse-MF-SMDF030-2]
F11  0.8A Trip  [Fuse-MF-SMDF030-2]
F12  0.8A Trip  [Fuse-MF-SMDF030-2]
F13  0.8A Trip  [Fuse-MF-SMDF030-2]
F14  0.8A Trip  [Fuse-MF-SMDF030-2]
F15  0.8A Trip  [Fuse-MF-SMDF030-2]
K8  PVG612PBF  [PVG612PBF]
K9  PVG612PBF  [PVG612PBF]
K10  PVG612PBF  [PVG612PBF]
K11  PVG612PBF  [PVG612PBF]
K12  PVG612PBF  [PVG612PBF]
K13  PVG612PBF  [PVG612PBF]
K14  PVG612PBF  [PVG612PBF]
K15  PVG612PBF  [PVG612PBF]
LED14  LED-0603  [LED-0603]
LED15  LED-0603  [LED-0603]
LED16  LED-0603  [LED-0603]
LED17  LED-0603  [LED-0603]
LED18  LED-0603  [LED-0603]
LED19  LED-0603  [LED-0603]
LED20  LED-0603  [LED-0603]
LED21  LED-0603  [LED-0603]
Q14  BSS138  [BSS138-SOT23]
Q15  BSS138  [BSS138-SOT23]
Q16  BSS138  [BSS138-SOT23]
Q17  BSS138  [BSS138-SOT23]
Q18  BSS138  [BSS138-SOT23]
Q19  BSS138  [BSS138-SOT23]
Q20  BSS138  [BSS138-SOT23]
Q21  BSS138  [BSS138-SOT23]
R22  169R  [NonPolar-0603]
R23  169R  [NonPolar-0603]
R24  47R  [NonPolar-0603]
R25  47R  [NonPolar-0603]
R26  10k  [NonPolar-0603]
R27  10k  [NonPolar-0603]
R28  169R  [NonPolar-0603]
R29  169R  [NonPolar-0603]
R30  47R  [NonPolar-0603]
R31  47R  [NonPolar-0603]
R32  10k  [NonPolar-0603]
R33  10k  [NonPolar-0603]
R34  169R  [NonPolar-0603]
R35  169R  [NonPolar-0603]
R36  47R  [NonPolar-0603]
R37  47R  [NonPolar-0603]
R38  10k  [NonPolar-0603]
R39  10k  [NonPolar-0603]
R40  169R  [NonPolar-0603]
R41  169R  [NonPolar-0603]
R42  47R  [NonPolar-0603]
R43  47R  [NonPolar-0603]
R44  10k  [NonPolar-0603]
R45  10k  [NonPolar-0603]

### Ports
D1, D1_EN, D2, D2_EN, D3, D3_EN, D4, D4_EN, D5, D5_EN, D6, D6_EN, D7, D7_EN, D8, D8_EN

### Nets
3V3DC: C57.2 C58.2 C59.2 C60.2 C61.2 C62.2 C63.2 C64.2 R22.1 R23.1 R24.1 R25.1 R28.1 R29.1 R30.1 R31.1 R34.1 R35.1 R36.1 R37.1 R40.1 R41.1 R42.1 R43.1
24VAC: K8.6 K9.6 K10.6 K11.6 K12.6 K13.6 K14.6 K15.6
GND: C57.1 C58.1 C59.1 C60.1 C61.1 C62.1 C63.1 C64.1 Q14.2(S) Q15.2(S) Q16.2(S) Q17.2(S) Q18.2(S) Q19.2(S) Q20.2(S) Q21.2(S) R26.1 R27.1 R32.1 R33.1 R38.1 R39.1 R44.1 R45.1
NetF8_1: F8.1 K8.4
NetF8_2: F8.2 ; port D1
NetF9_1: F9.1 K9.4
NetF9_2: F9.2 ; port D2
NetF10_1: F10.1 K10.4
NetF10_2: F10.2 ; port D3
NetF11_1: F11.1 K11.4
NetF11_2: F11.2 ; port D4
NetF12_1: F12.1 K12.4
NetF12_2: F12.2 ; port D5
NetF13_1: F13.1 K13.4
NetF13_2: F13.2 ; port D6
NetF14_1: F14.1 K14.4
NetF14_2: F14.2 ; port D7
NetF15_1: F15.1 K15.4
NetF15_2: F15.2 ; port D8
NetK8_1: K8.1 R22.2
NetK8_2: K8.2 LED14.2 Q14.3(D)
NetK9_1: K9.1 R23.2
NetK9_2: K9.2 LED15.2 Q15.3(D)
NetK10_1: K10.1 R28.2
NetK10_2: K10.2 LED16.2 Q16.3(D)
NetK11_1: K11.1 R29.2
NetK11_2: K11.2 LED17.2 Q17.3(D)
NetK12_1: K12.1 R34.2
NetK12_2: K12.2 LED18.2 Q18.3(D)
NetK13_1: K13.1 R35.2
NetK13_2: K13.2 LED19.2 Q19.3(D)
NetK14_1: K14.1 R40.2
NetK14_2: K14.2 LED20.2 Q20.3(D)
NetK15_1: K15.1 R41.2
NetK15_2: K15.2 LED21.2 Q21.3(D)
NetLED14_1: LED14.1 R24.2
NetLED15_1: LED15.1 R25.2
NetLED16_1: LED16.1 R30.2
NetLED17_1: LED17.1 R31.2
NetLED18_1: LED18.1 R36.2
NetLED19_1: LED19.1 R37.2
NetLED20_1: LED20.1 R42.2
NetLED21_1: LED21.1 R43.2
NetQ14_1: Q14.1(G) R26.2 ; port D1_EN
NetQ15_1: Q15.1(G) R27.2 ; port D2_EN
NetQ16_1: Q16.1(G) R32.2 ; port D3_EN
NetQ17_1: Q17.1(G) R33.2 ; port D4_EN
NetQ18_1: Q18.1(G) R38.2 ; port D5_EN
NetQ19_1: Q19.1(G) R39.2 ; port D6_EN
NetQ20_1: Q20.1(G) R44.2 ; port D7_EN
NetQ21_1: Q21.1(G) R45.2 ; port D8_EN

Not connected (* = marked no-connect by the designer): K8 3(18)* 5(14)*; K9 3(18)* 5(14)*; K10 3(18)* 5(14)*; K11 3(18)* 5(14)*; K12 3(18)* 5(14)*; K13 3(18)* 5(14)*; K14 3(18)* 5(14)*; K15 3(18)* 5(14)*

### Notes on the sheet
- (near R24) 0402
- 50V
- (near R24) 0603
- (near R22) 0603
- 0402
- (near R25) 0603
- (near R23) 0603
- X7R
- (near K8) DIP-6
- (near F8) MF-SMDF030-2
- DIP-6
- 0603
- (near Q14) SOT-23-3
- (near Q15) SOT-23-3
- (near F9) MF-SMDF030-2
- (near R30) 0603
- (near R28) 0603
- (near R31) 0603
- (near R29) 0603
- (near K10) DIP-6
- (near F10) MF-SMDF030-2
- (near K11) DIP-6
- (near Q16) SOT-23-3
- (near Q17) SOT-23-3
- (near F11) MF-SMDF030-2
- (near R36) 0402
- (near R36) 0603
- (near R34) 0603
- (near F12) MF-SMDF030-2
- (near R37) 0603
- (near R35) 0603
- (near Q18) SOT-23-3
- (near K12) DIP-6
- (near Q19) 0603
- (near Q19) SOT-23-3
- (near K13) DIP-6
- (near F13) MF-SMDF030-2
- (near R40) 0603
- (near R41) 0603
- (near R42) 0603
- (near K14) DIP-6
- (near F14) MF-SMDF030-2
- (near R43) 0603
- (near K15) DIP-6
- (near Q20) 0603
- (near Q20) SOT-23-3
- (near Q21) 0603
- (near Q21) SOT-23-3
- (near F15) MF-SMDF030-2
- GRAVHAC
- Title
- Size:
- Date:
- B
- Drawn By:
- Revision:
- Sheet
- of
- File:

### Library data of the parts
C57-C64 = Cap - 0402
F8-F15 = Fuse-MF-SMDF030-2
K8-K15 = PVG612PBF: PhotoVoltaic Relay
R22-R45 = Res - 0603

## Sheet HEADERS_HAS_CCU.SchDoc: CCU - Headers/Power
size B; DrawnBy: M. Seago; Organization: Gravitas; Address1: Sponsored By:; Address2: Alan Morgan; Address3: Technical Advisor:; Address4: Dr. Joseph Morgan; Revision: 1A; SheetNumber: 9; SheetTotal: 9
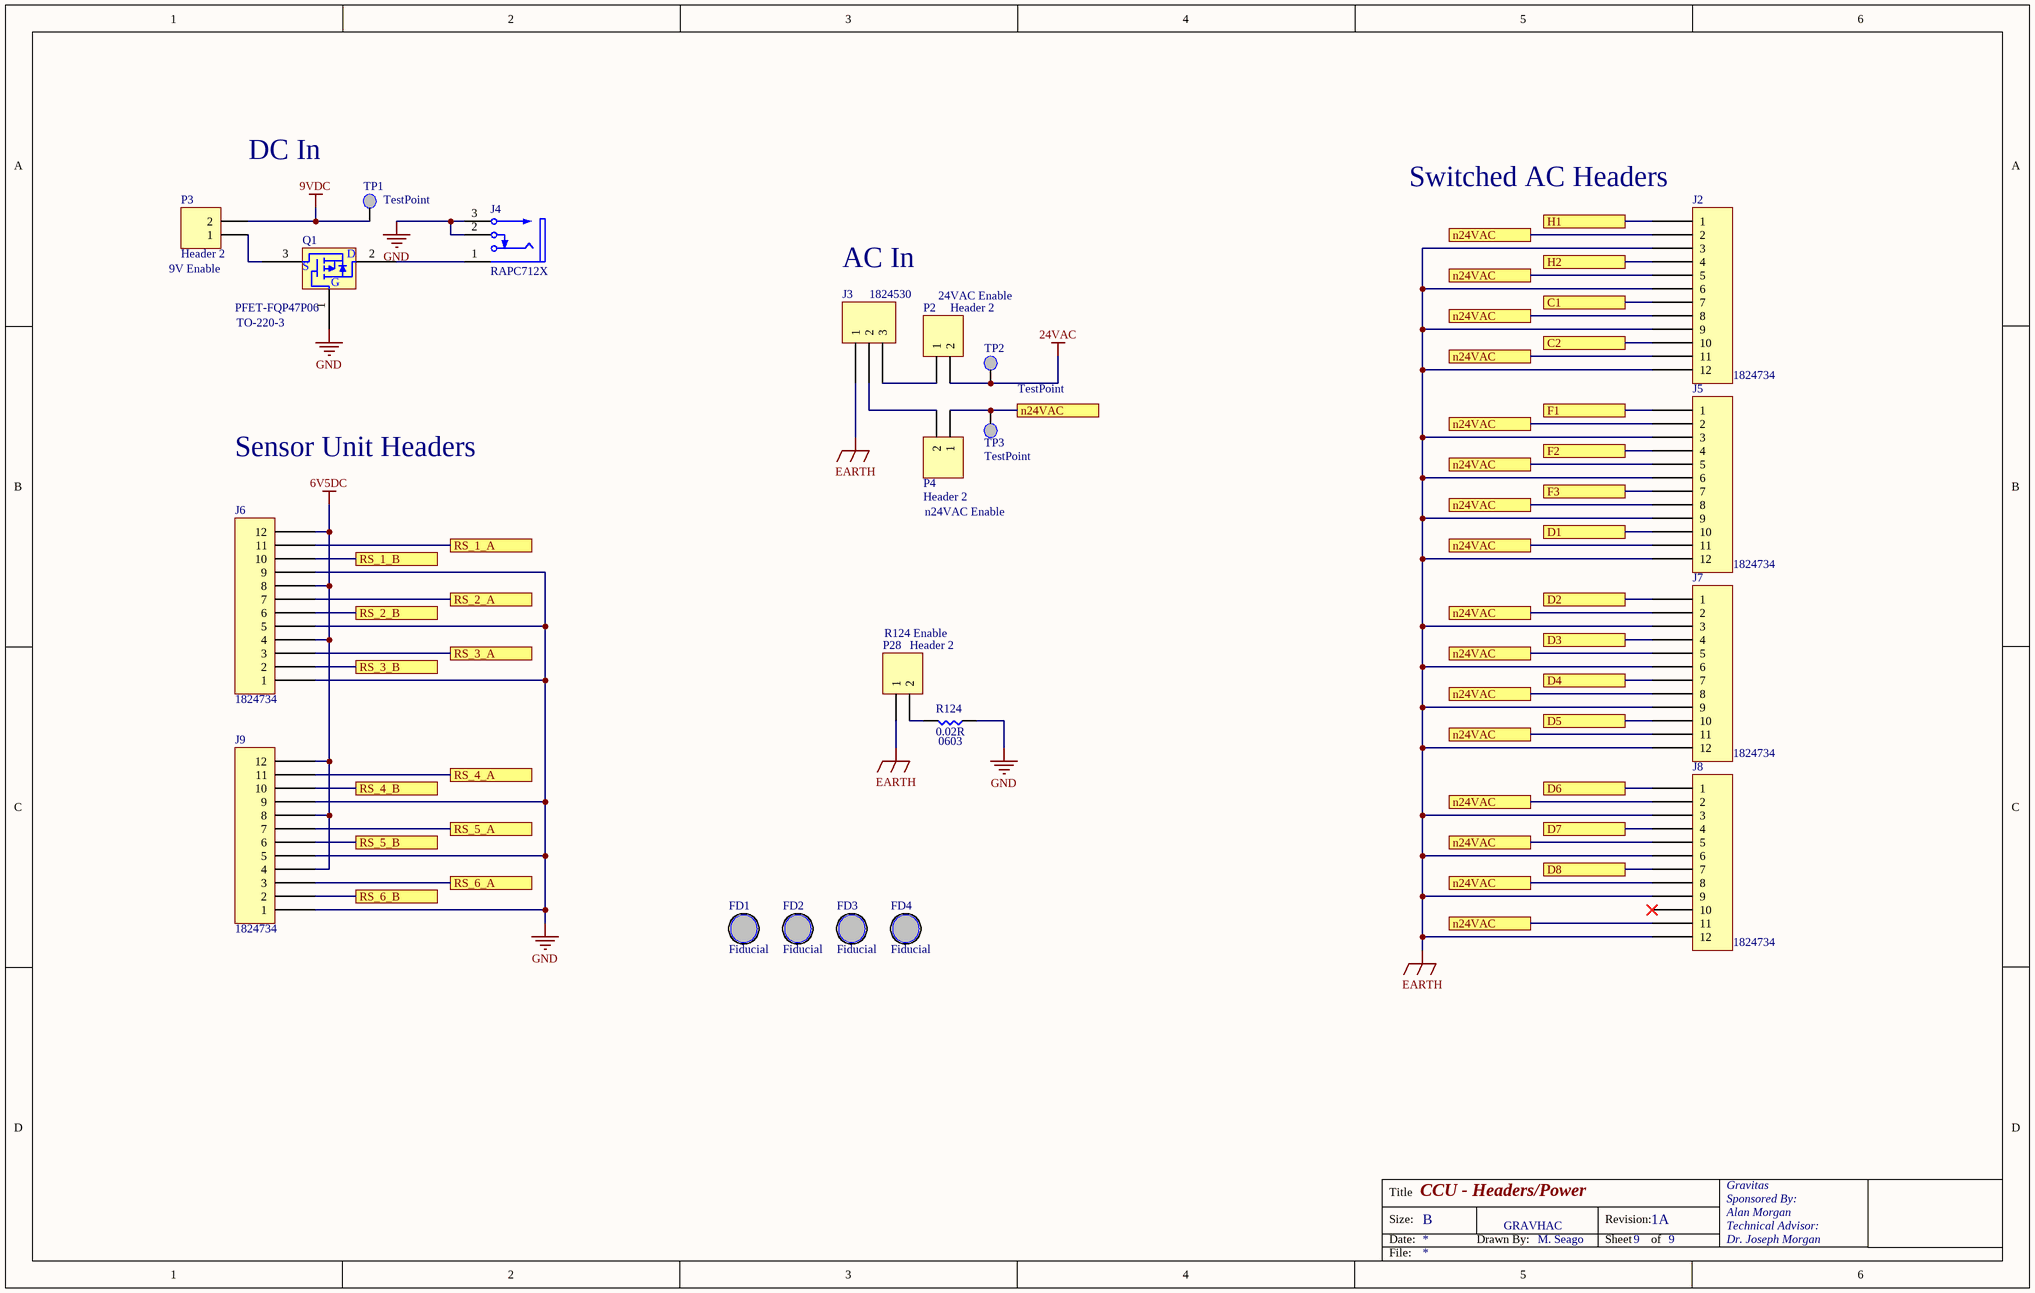
[diagram p8: HEADERS_HAS_CCU.SchDoc]

### Parts
FD1  Fiducial  [Fiducial]
FD2  Fiducial  [Fiducial]
FD3  Fiducial  [Fiducial]
FD4  Fiducial  [Fiducial]
J2  1824734  [1824734]
J3  1824530  [1824530]
J4  RAPC712X  [SWITCH-RAPC712X-3_V]
J5  1824734  [1824734]
J6  1824734  [1824734]
J7  1824734  [1824734]
J8  1824734  [1824734]
J9  1824734  [1824734]
P2  Header 2  [HDR1X2]
P3  Header 2  [HDR1X2]
P4  Header 2  [HDR1X2]
P28  Header 2  [HDR1X2]
Q1  PFET-FQP47P06  [3-PIn?]
R124  0.02R  [NonPolar-0603]
TP1  TestPoint  [TP - S2751-46R]
TP2  TestPoint  [TP - S2751-46R]
TP3  TestPoint  [TP - S2751-46R]

### Ports
C1, C2, D1, D2, D3, D4, D5, D6, D7, D8, F1, F2, F3, H1, H2, n24VAC, RS_1_A, RS_1_B, RS_2_A, RS_2_B, RS_3_A, RS_3_B, RS_4_A, RS_4_B, RS_5_A, RS_5_B, RS_6_A, RS_6_B

### Nets
6V5DC: J6.4 J6.8 J6.12 J9.4 J9.8 J9.12
9VDC: P3.2 TP1.1
24VAC: P2.2 TP2.1
EARTH: J2.3 J2.6 J2.9 J2.12 J3.1 J5.3 J5.6 J5.9 J5.12 J7.3 J7.6 J7.9 J7.12 J8.3 J8.6 J8.9 J8.12 P28.1
GND: J4.2 J4.3 J6.1 J6.5 J6.9 J9.1 J9.5 J9.9 Q1.1 R124.2
NetF1_2: J2.1 ; port H1
NetF2_2: J2.4 ; port H2
NetF3_2: J2.7 ; port C1
NetF4_2: J2.10 ; port C2
NetF5_2: J5.1 ; port F1
NetF6_2: J5.4 ; port F2
NetF7_2: J5.7 ; port F3
NetF8_2: J5.10 ; port D1
NetF9_2: J7.1 ; port D2
NetF10_2: J7.4 ; port D3
NetF11_2: J7.7 ; port D4
NetF12_2: J7.10 ; port D5
NetF13_2: J8.1 ; port D6
NetF14_2: J8.4 ; port D7
NetF15_2: J8.7 ; port D8
NetJ2_2: J2.2 J2.5 J2.8 J2.11 J5.2 J5.5 J5.8 J5.11 J7.2 J7.5 J7.8 J7.11 J8.2 J8.5 J8.8 J8.11 P4.1 TP3.1 ; port n24VAC
NetJ3_2: J3.2 P4.2
NetJ3_3: J3.3 P2.1
NetJ4_1: J4.1 Q1.2
NetJ6_2: J6.2 ; port RS_3_B
NetJ6_3: J6.3 ; port RS_3_A
NetJ6_6: J6.6 ; port RS_2_B
NetJ6_7: J6.7 ; port RS_2_A
NetJ6_10: J6.10 ; port RS_1_B
NetJ6_11: J6.11 ; port RS_1_A
NetJ9_2: J9.2 ; port RS_6_B
NetJ9_3: J9.3 ; port RS_6_A
NetJ9_6: J9.6 ; port RS_5_B
NetJ9_7: J9.7 ; port RS_5_A
NetJ9_10: J9.10 ; port RS_4_B
NetJ9_11: J9.11 ; port RS_4_A
NetP3_1: P3.1 Q1.3
NetP28_2: P28.2 R124.1

Not connected (* = marked no-connect by the designer): J8 10*

### Notes on the sheet
- DC In
- (near J2) Switched AC Headers
- (near P3) 9V Enable
- AC In
- 24VAC Enable
- (near Q1) TO-220-3
- Sensor Unit Headers
- n24VAC Enable
- R124 Enable
- (near R124) 0603
- GRAVHAC
- Title
- Size:
- Date:
- B
- Drawn By:
- Revision:
- Sheet
- of
- File:
- (in symbol PFET-FQP47P06) D; S; G

### Library data of the parts
FD1-FD4 = Fiducial: 1mm pad, 2mm mask, 2mm KO
J4 = CMP-2000-05383-1: Conn Powerjack Mini R/A PCMT, 5 A, 3-Pin THD, RoHS; Manufacturer: Switchcraft; Gender: Male; Current Rating: 5A; Connector Type: Jack; Dynamic Catalog: SwitchcraftInc; Other Names: Q2387461 / Q2526383 / RAPC712X-ND / SC237; Internal Switch(s): SingleSwitch,NormallyClosed; Catalog Drawings: RAPC7(1,2)2XSide / RAPC7(1,2)2XTop; Plug/Mating Plug Diameter: 2.5mmID,5.5mmOD; Number of Positions/Contacts: 2Conductors,2Contacts; Shielding: Unshielded; Mating Products: SC1539-ND / -CONNPLUGMINIPWR2CONDBLK/RED / SC1051-ND / -CONNPLUGMINIPOWER2CONDBLACK; Mounting Type: ThroughHole,RightAngle; Manufacturer URL: http://www.switchcraft.com/; Contact Material: Brass; Standard Package: 2,500; RoHS Information: SwitchcraftRoHSInfo; Termination: SolderEyelet(s); Housing Color: Black; Datasheet Version: Rev. A, 08/2005; Family: Barrel-PowerConnectors; Housing Material: Thermoplastic; Color: Black; Datasheet URL: https://datasheet.ciiva.com/391/rapc712x-cd-391666.pdf; Category: Connectors,Interconnects; Contact Material - Plating: Nickel
P2-P4 P28 = Header 2: Header, 2-Pin; LatestRevisionDate: 17-Jul-2002; LatestRevisionNote: Re-released for DXP Platform.; Publisher: Altium Limited
R124 = Res - 0603
TP1-TP3 = TestPoint: S2751-46R